# EAGLE board haasoscope_pro_fpga_board - start of io (EAGLE 9.6.2), part 1 of 2
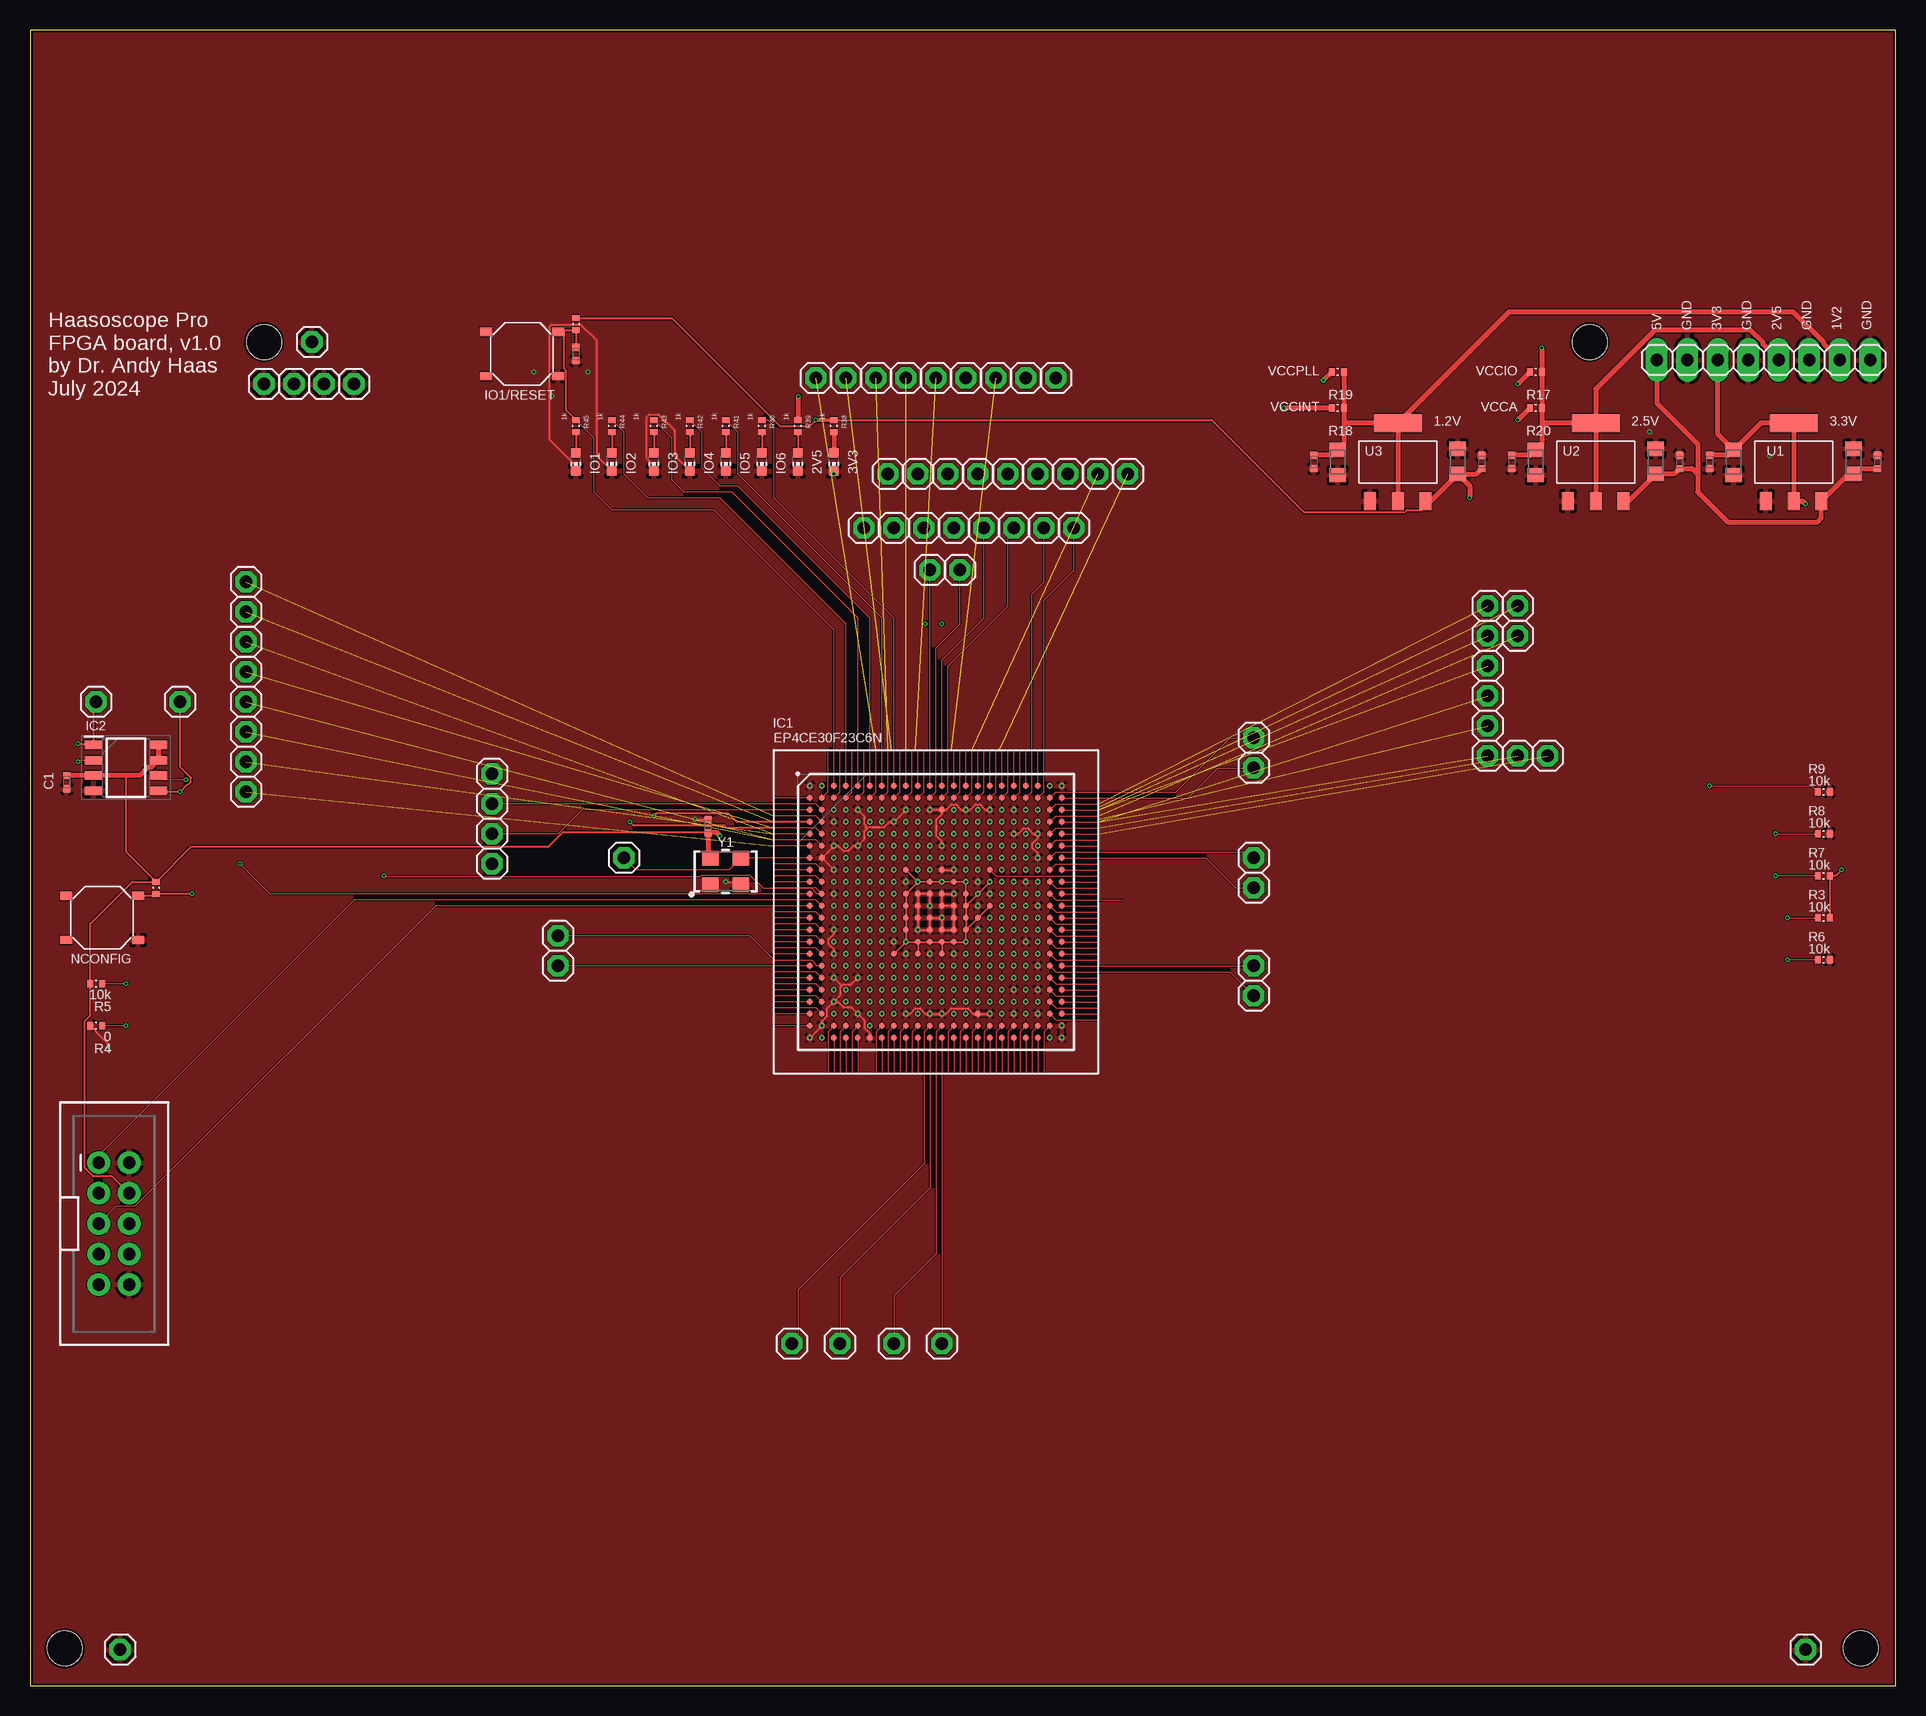
[diagram p4: board, top side]
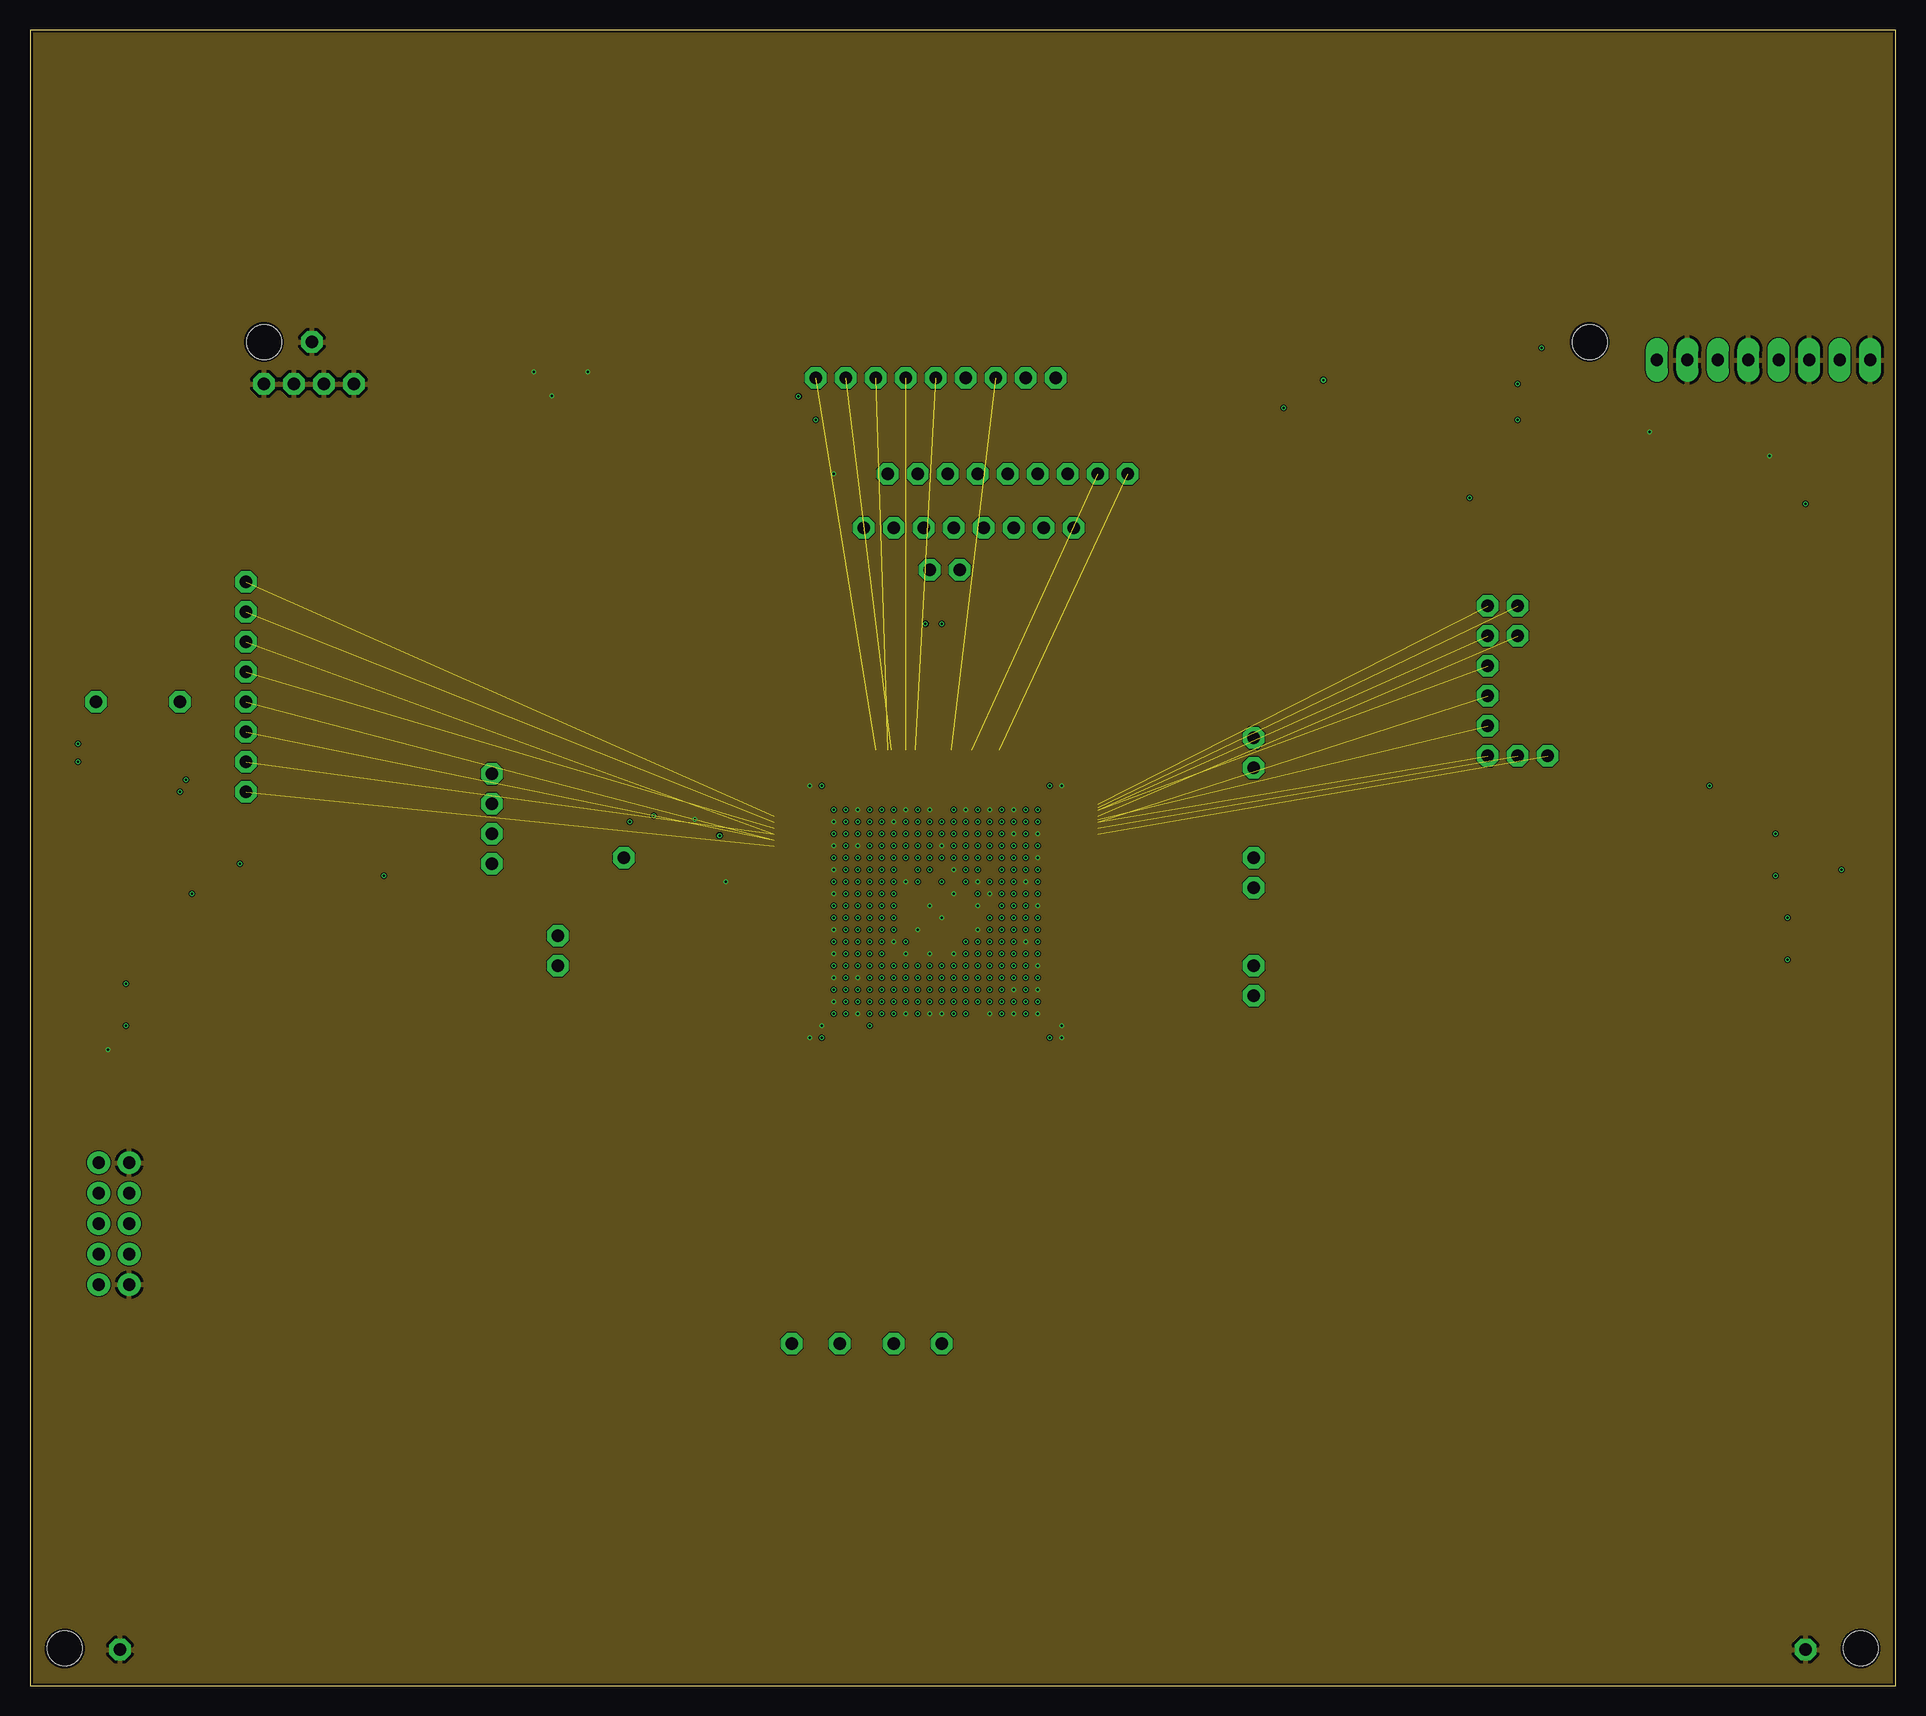
[diagram p5: board, inner layer topgnd]
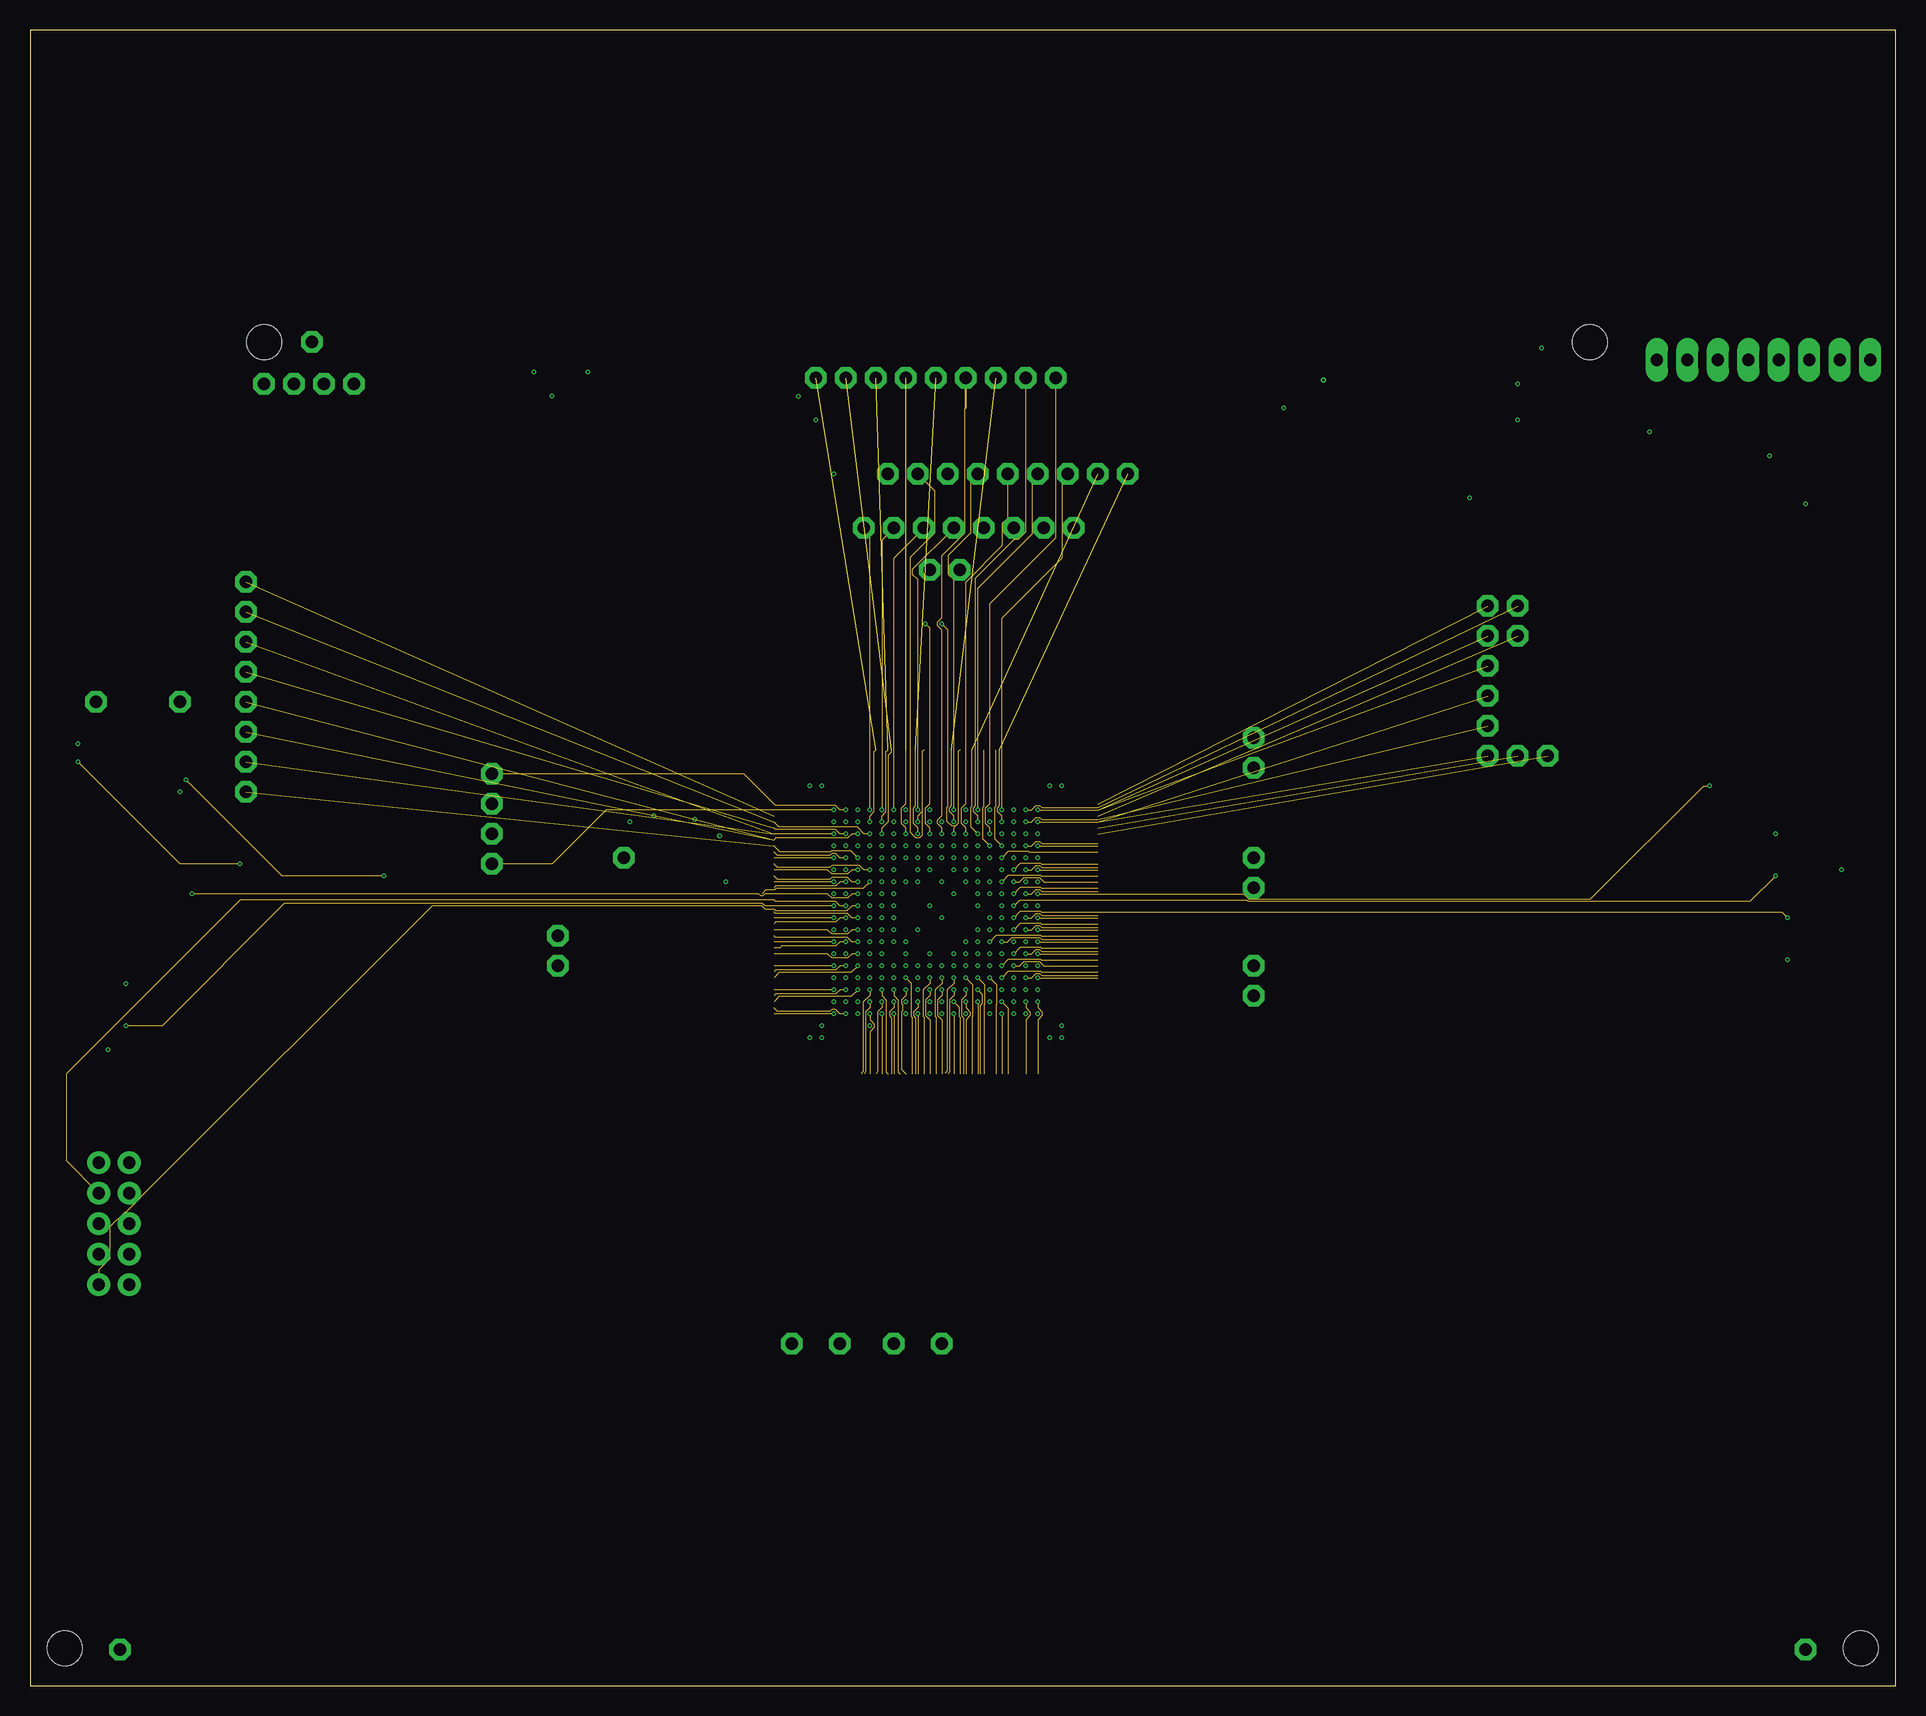
[diagram p6: board, inner layer sig2]
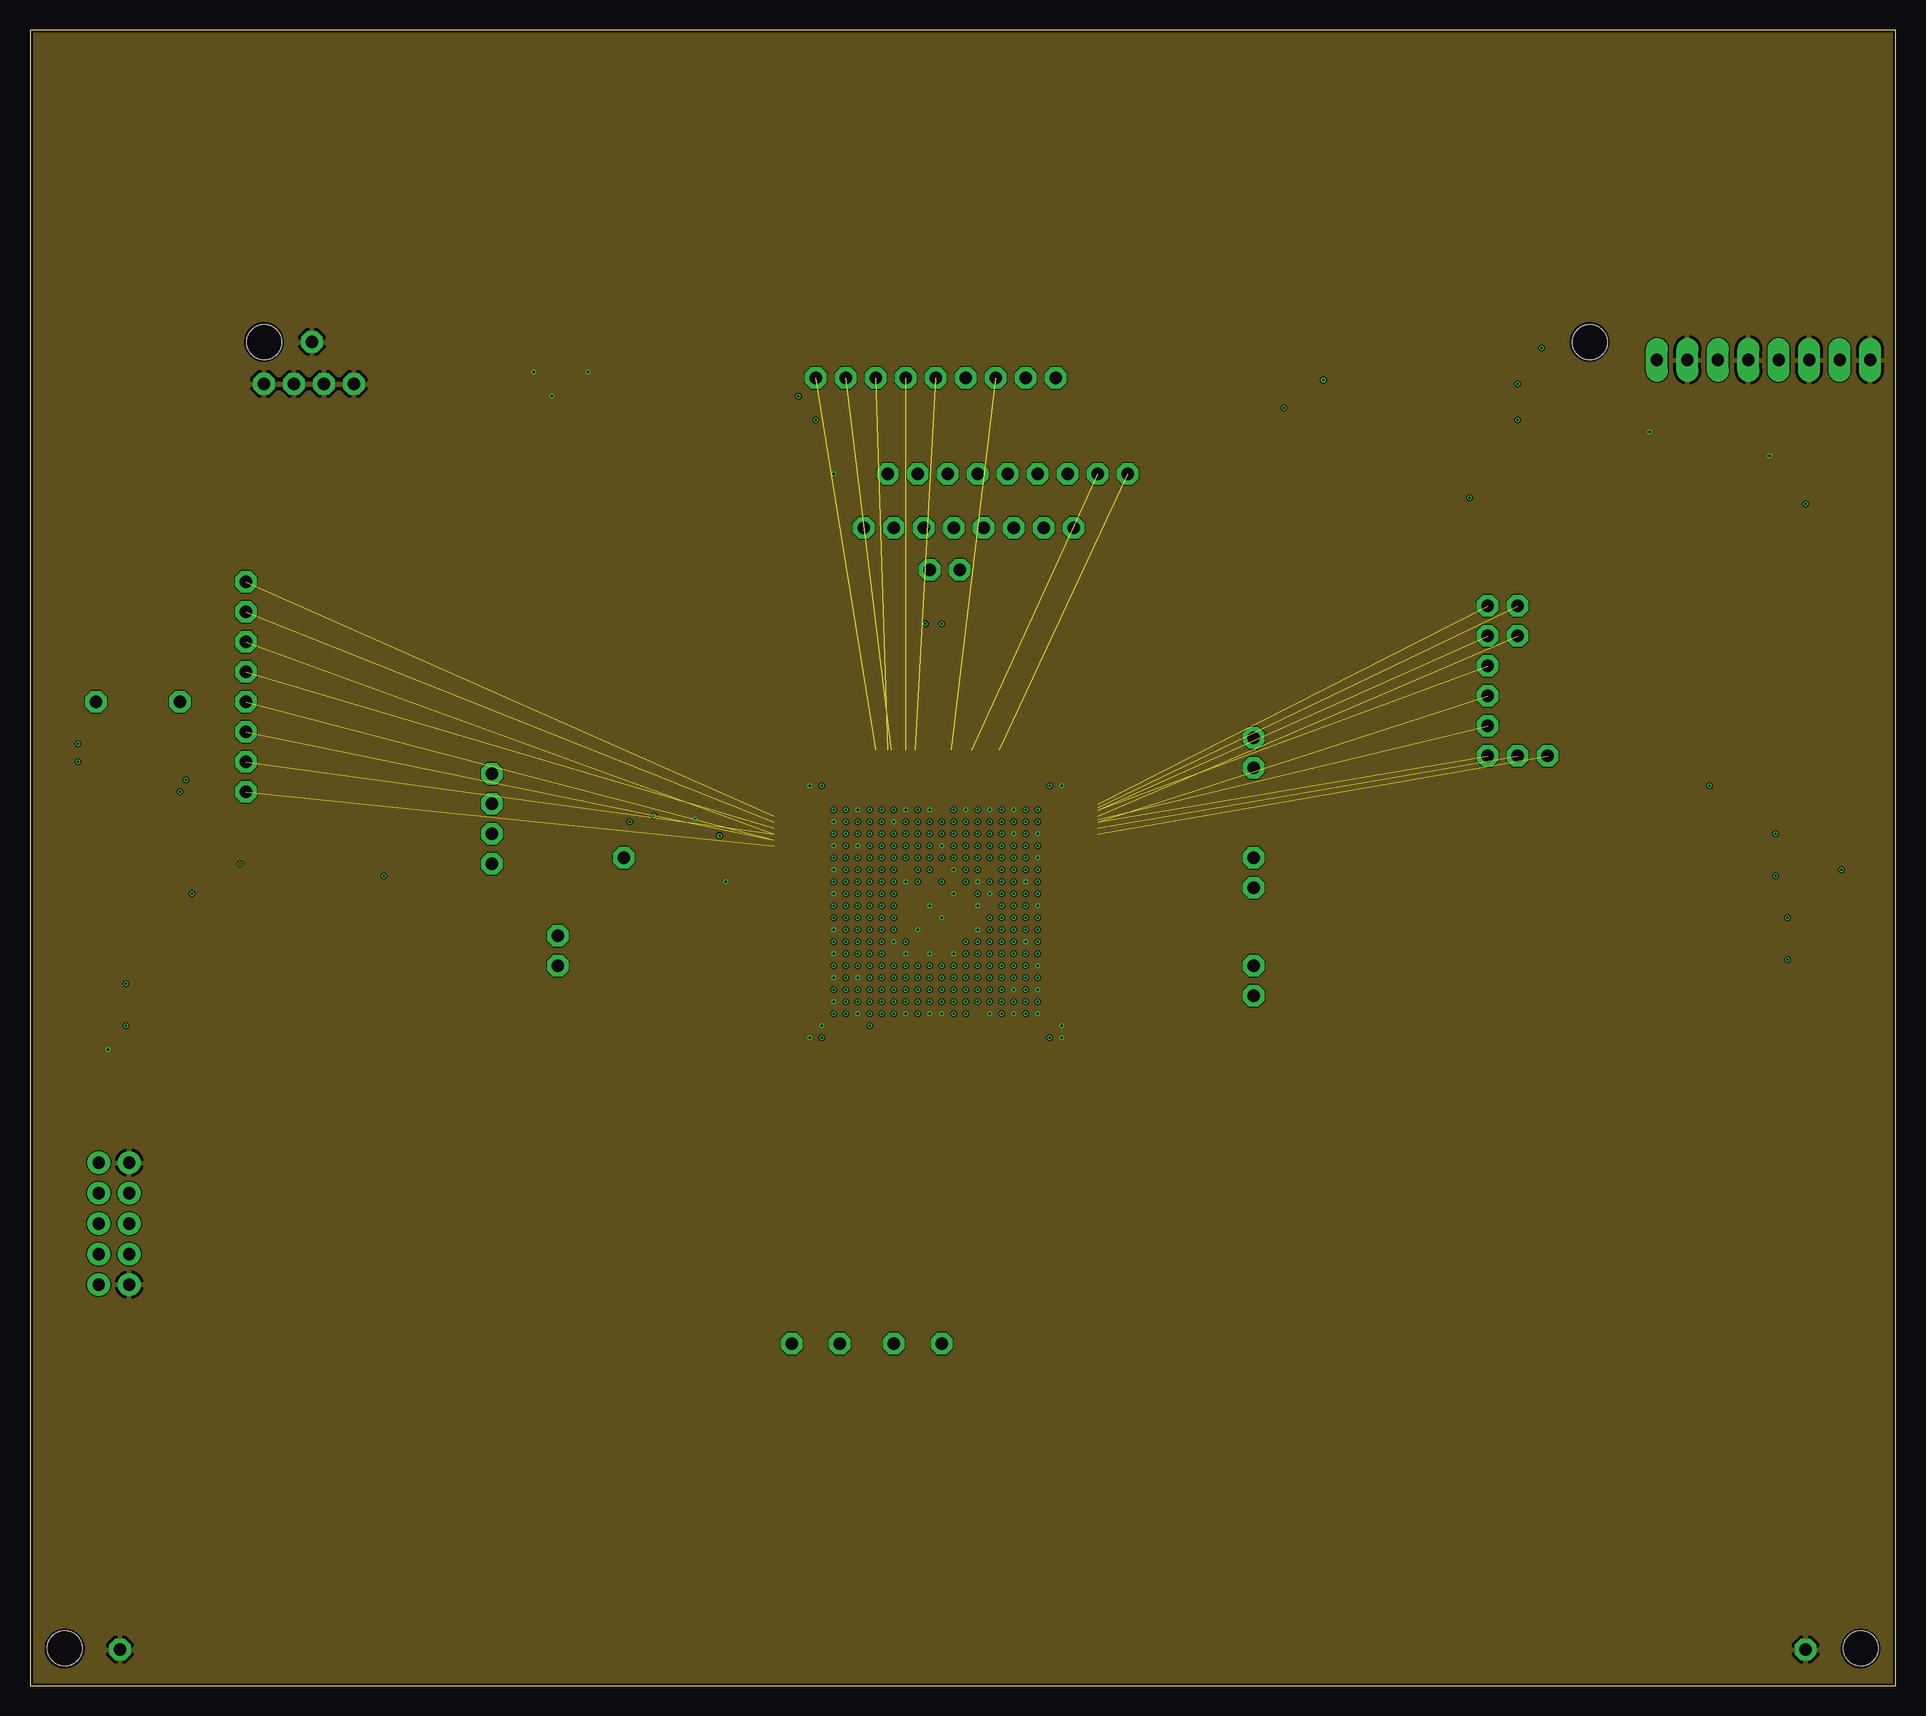
[diagram p7: board, inner layer sig2gnd]
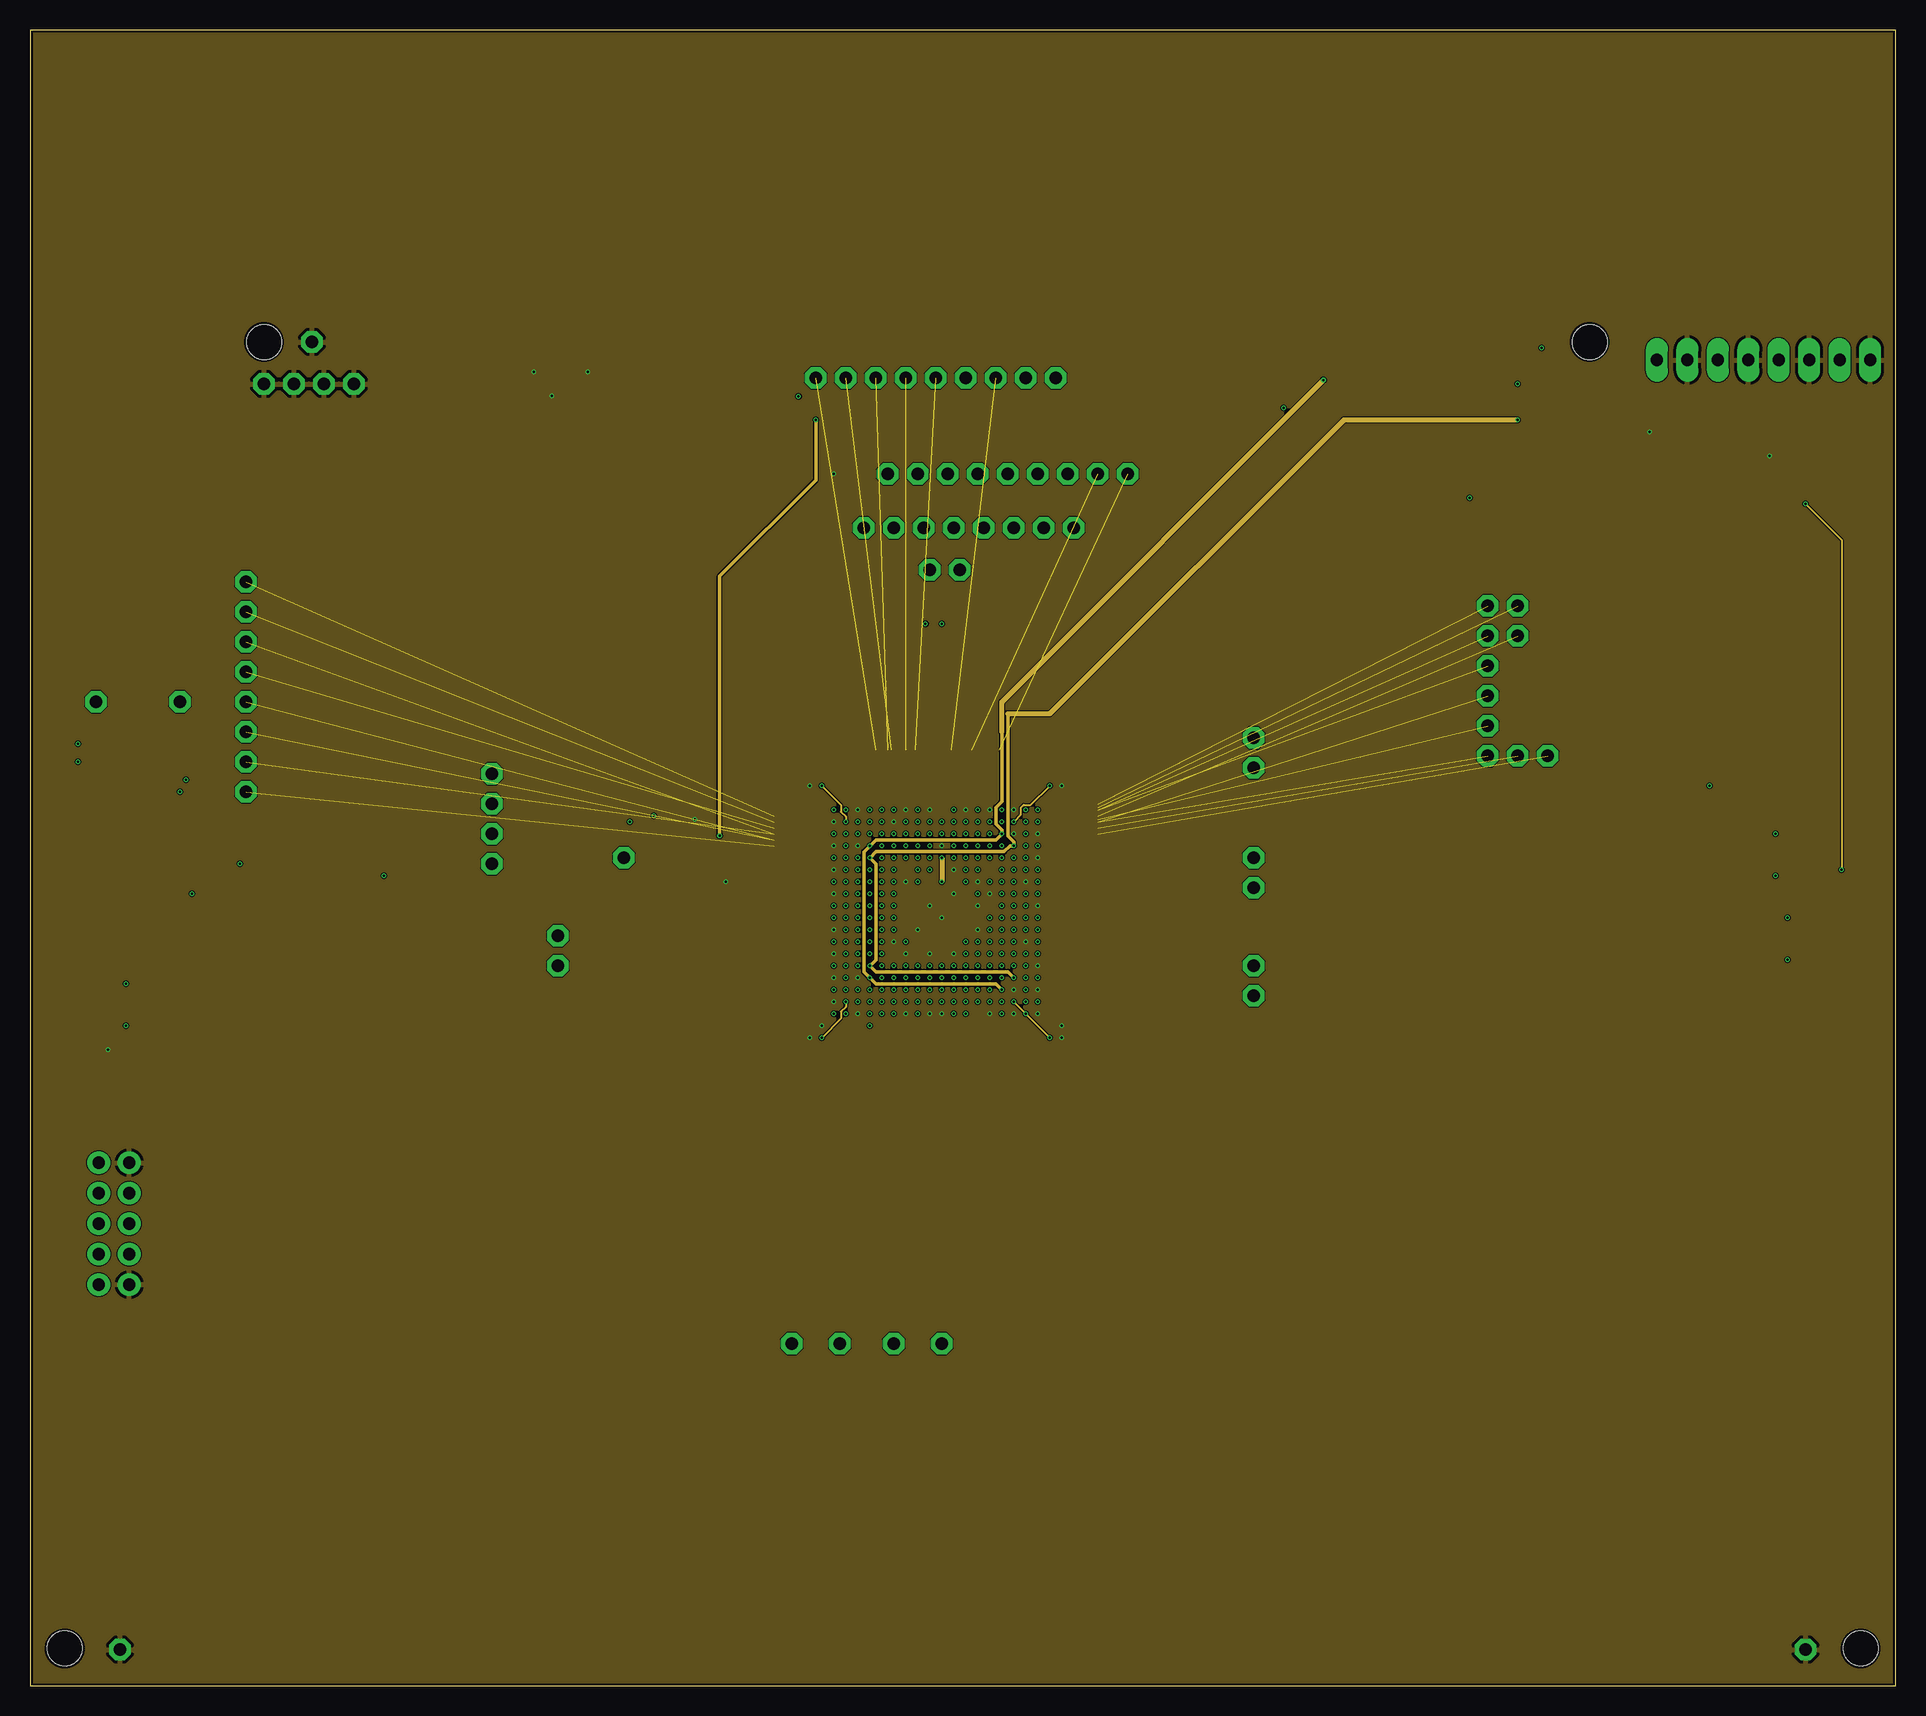
[diagram p8: board, inner layer pow1]
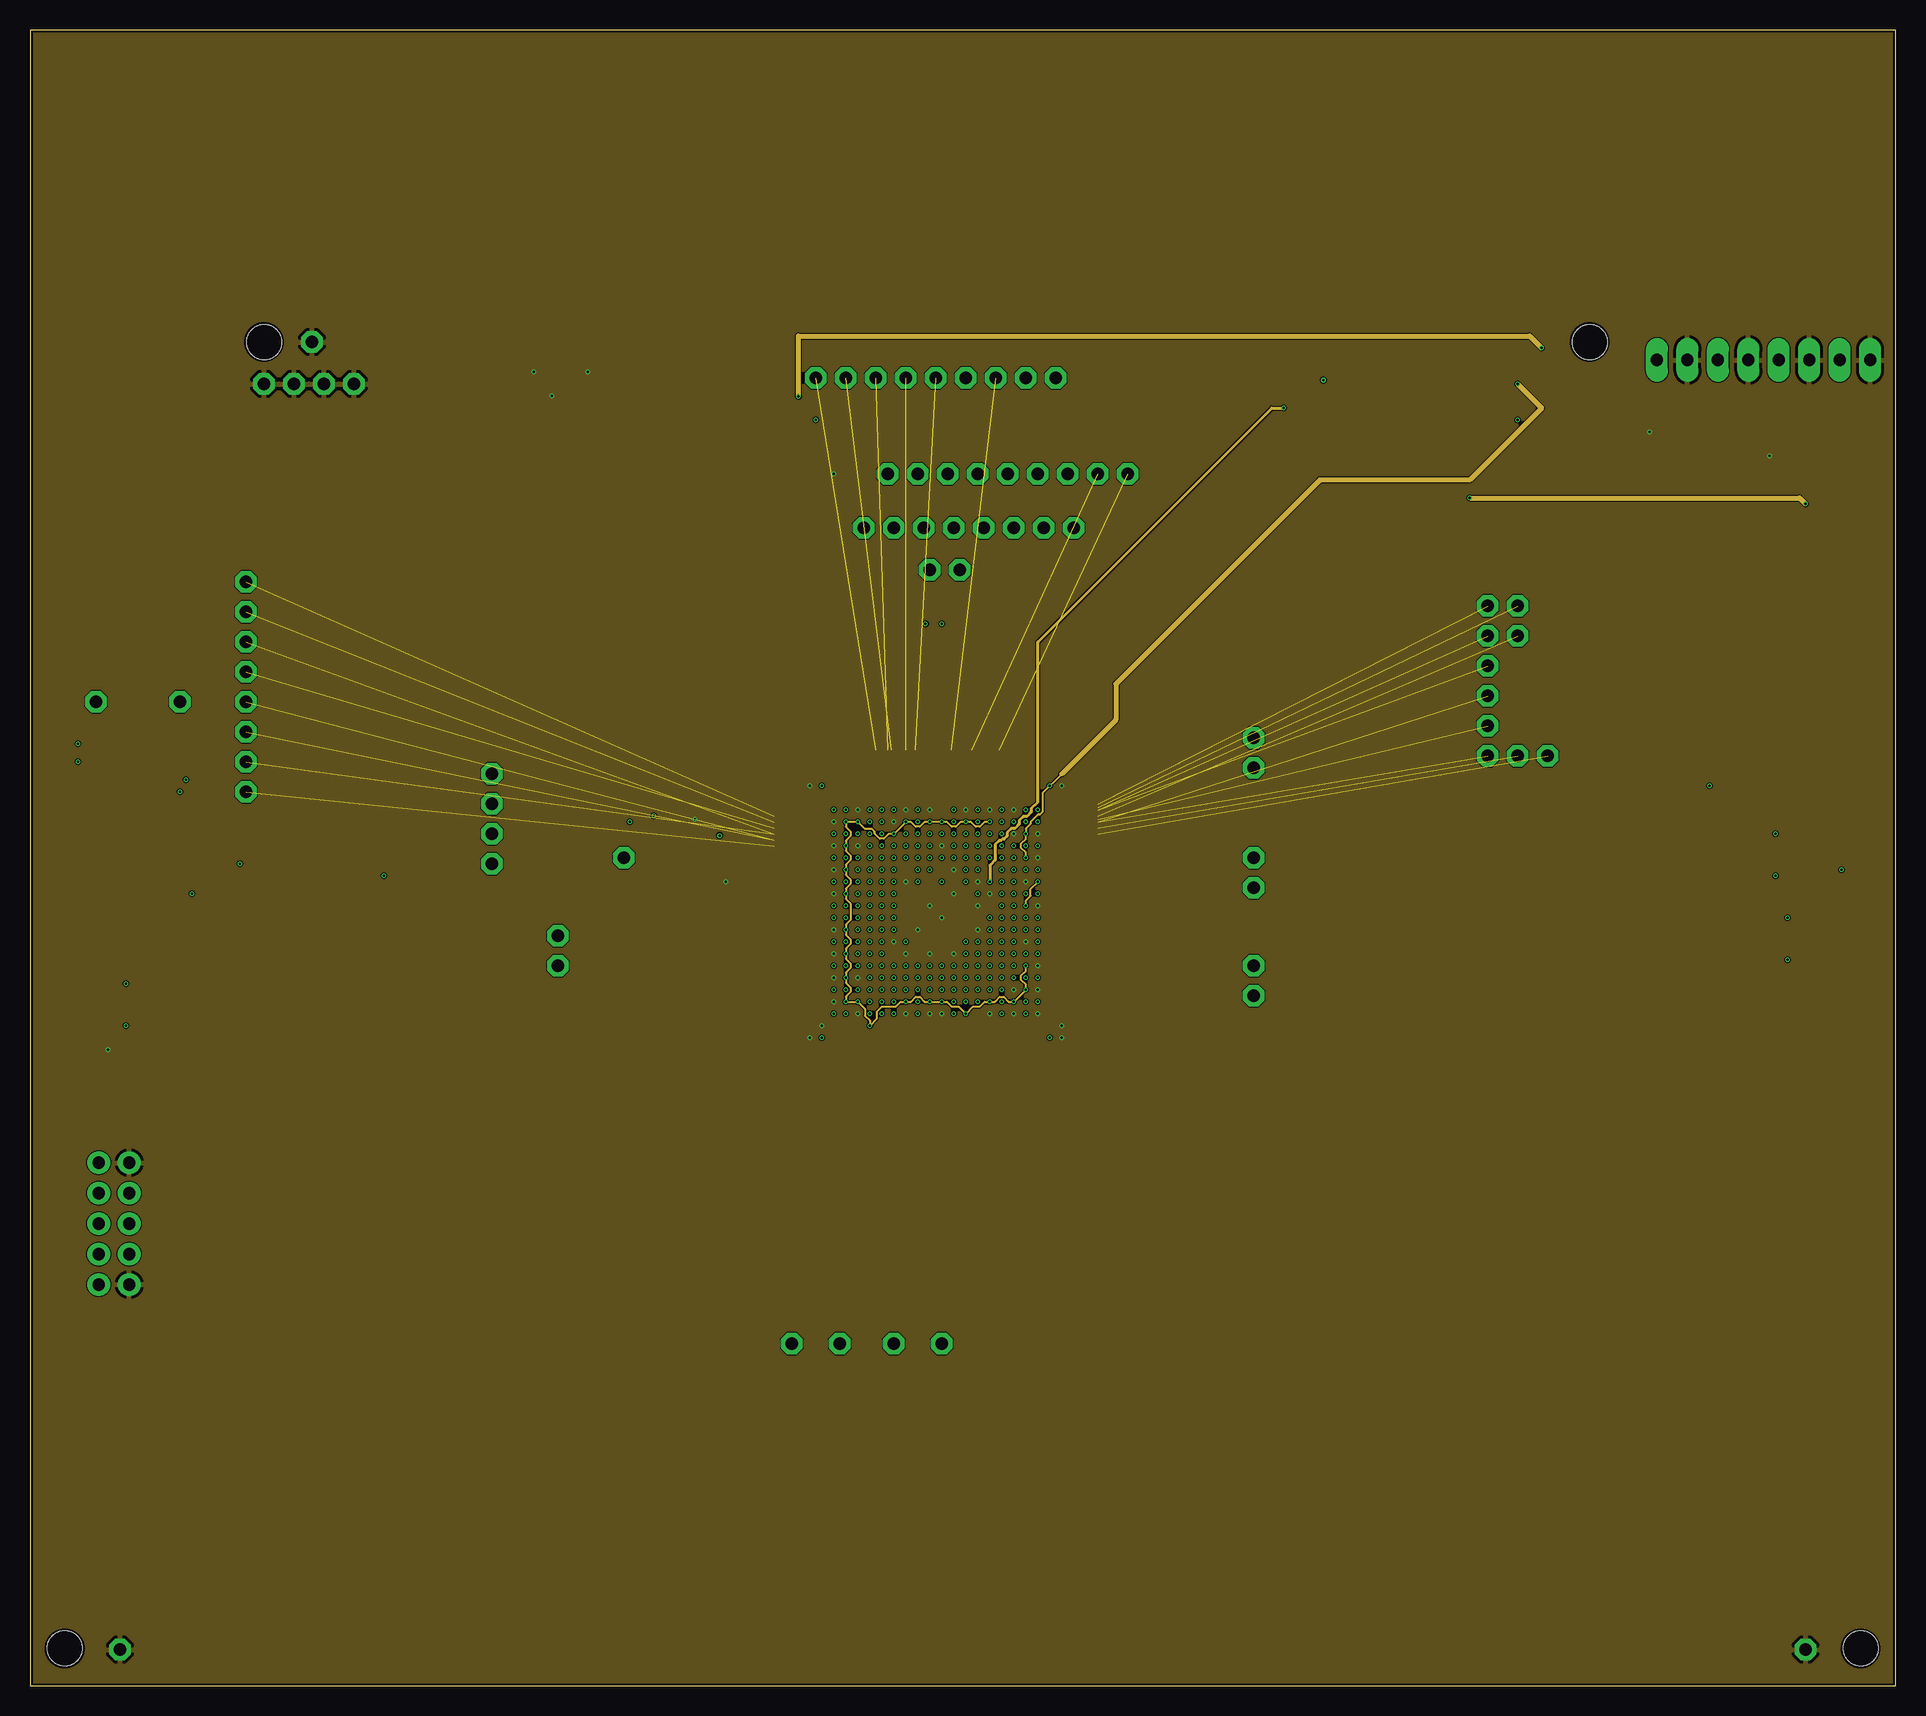
[diagram p9: board, inner layer pow2]
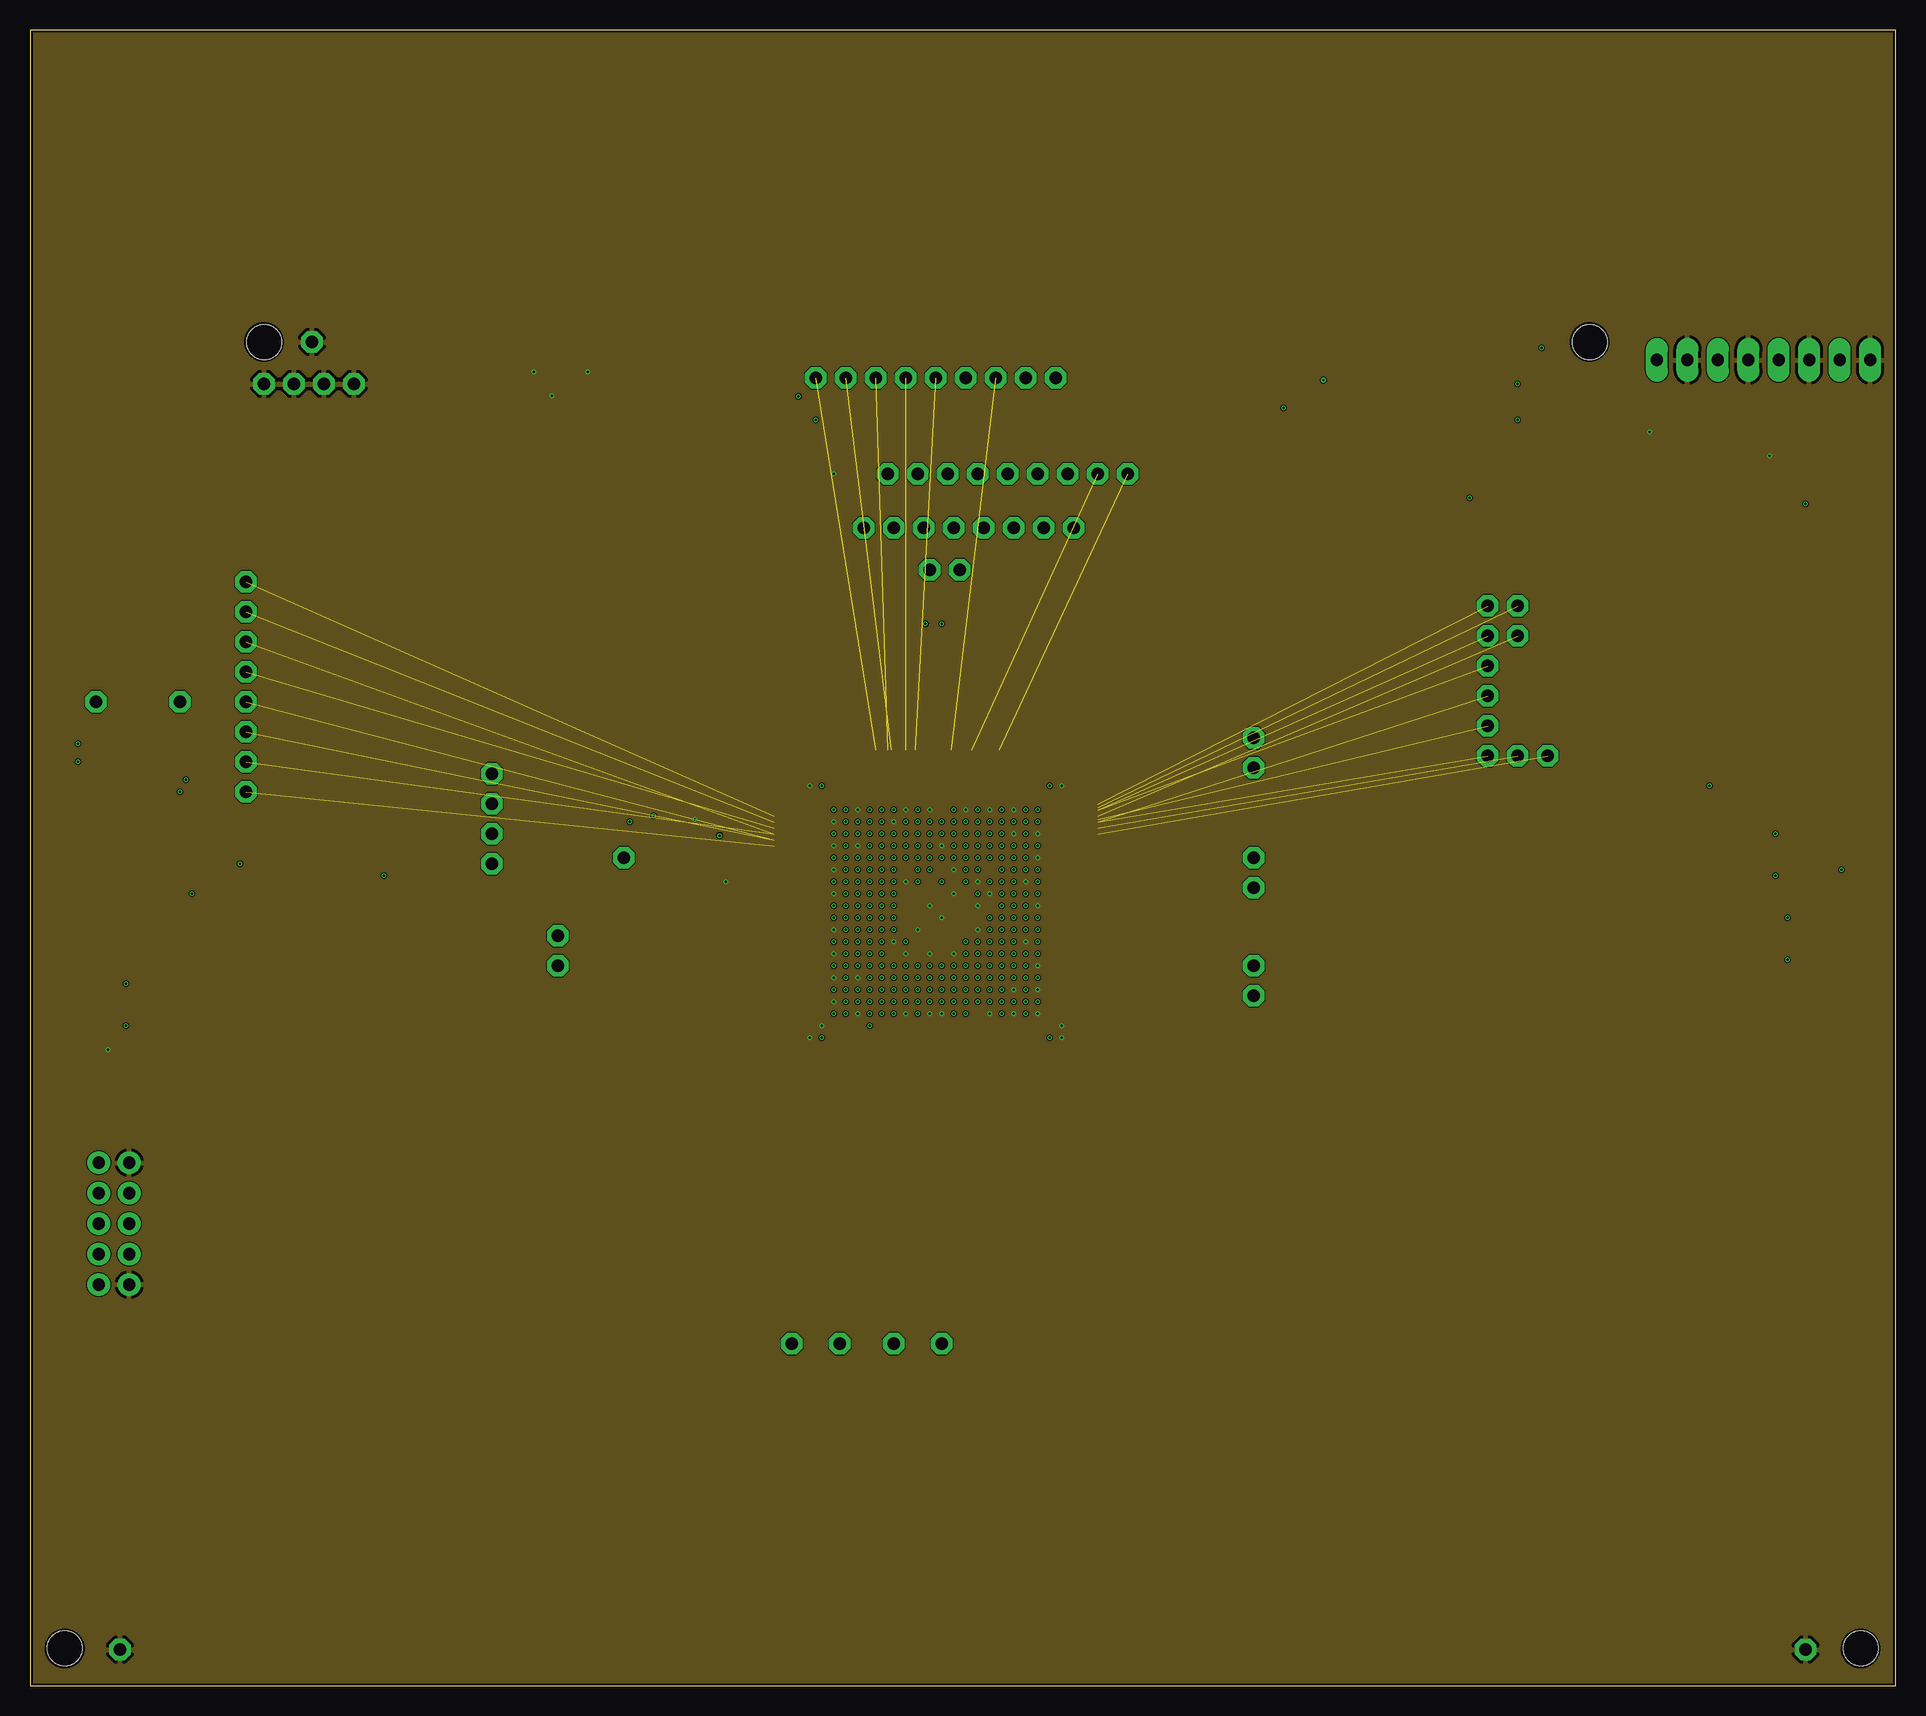
[diagram p10: board, inner layer sig4gnd]
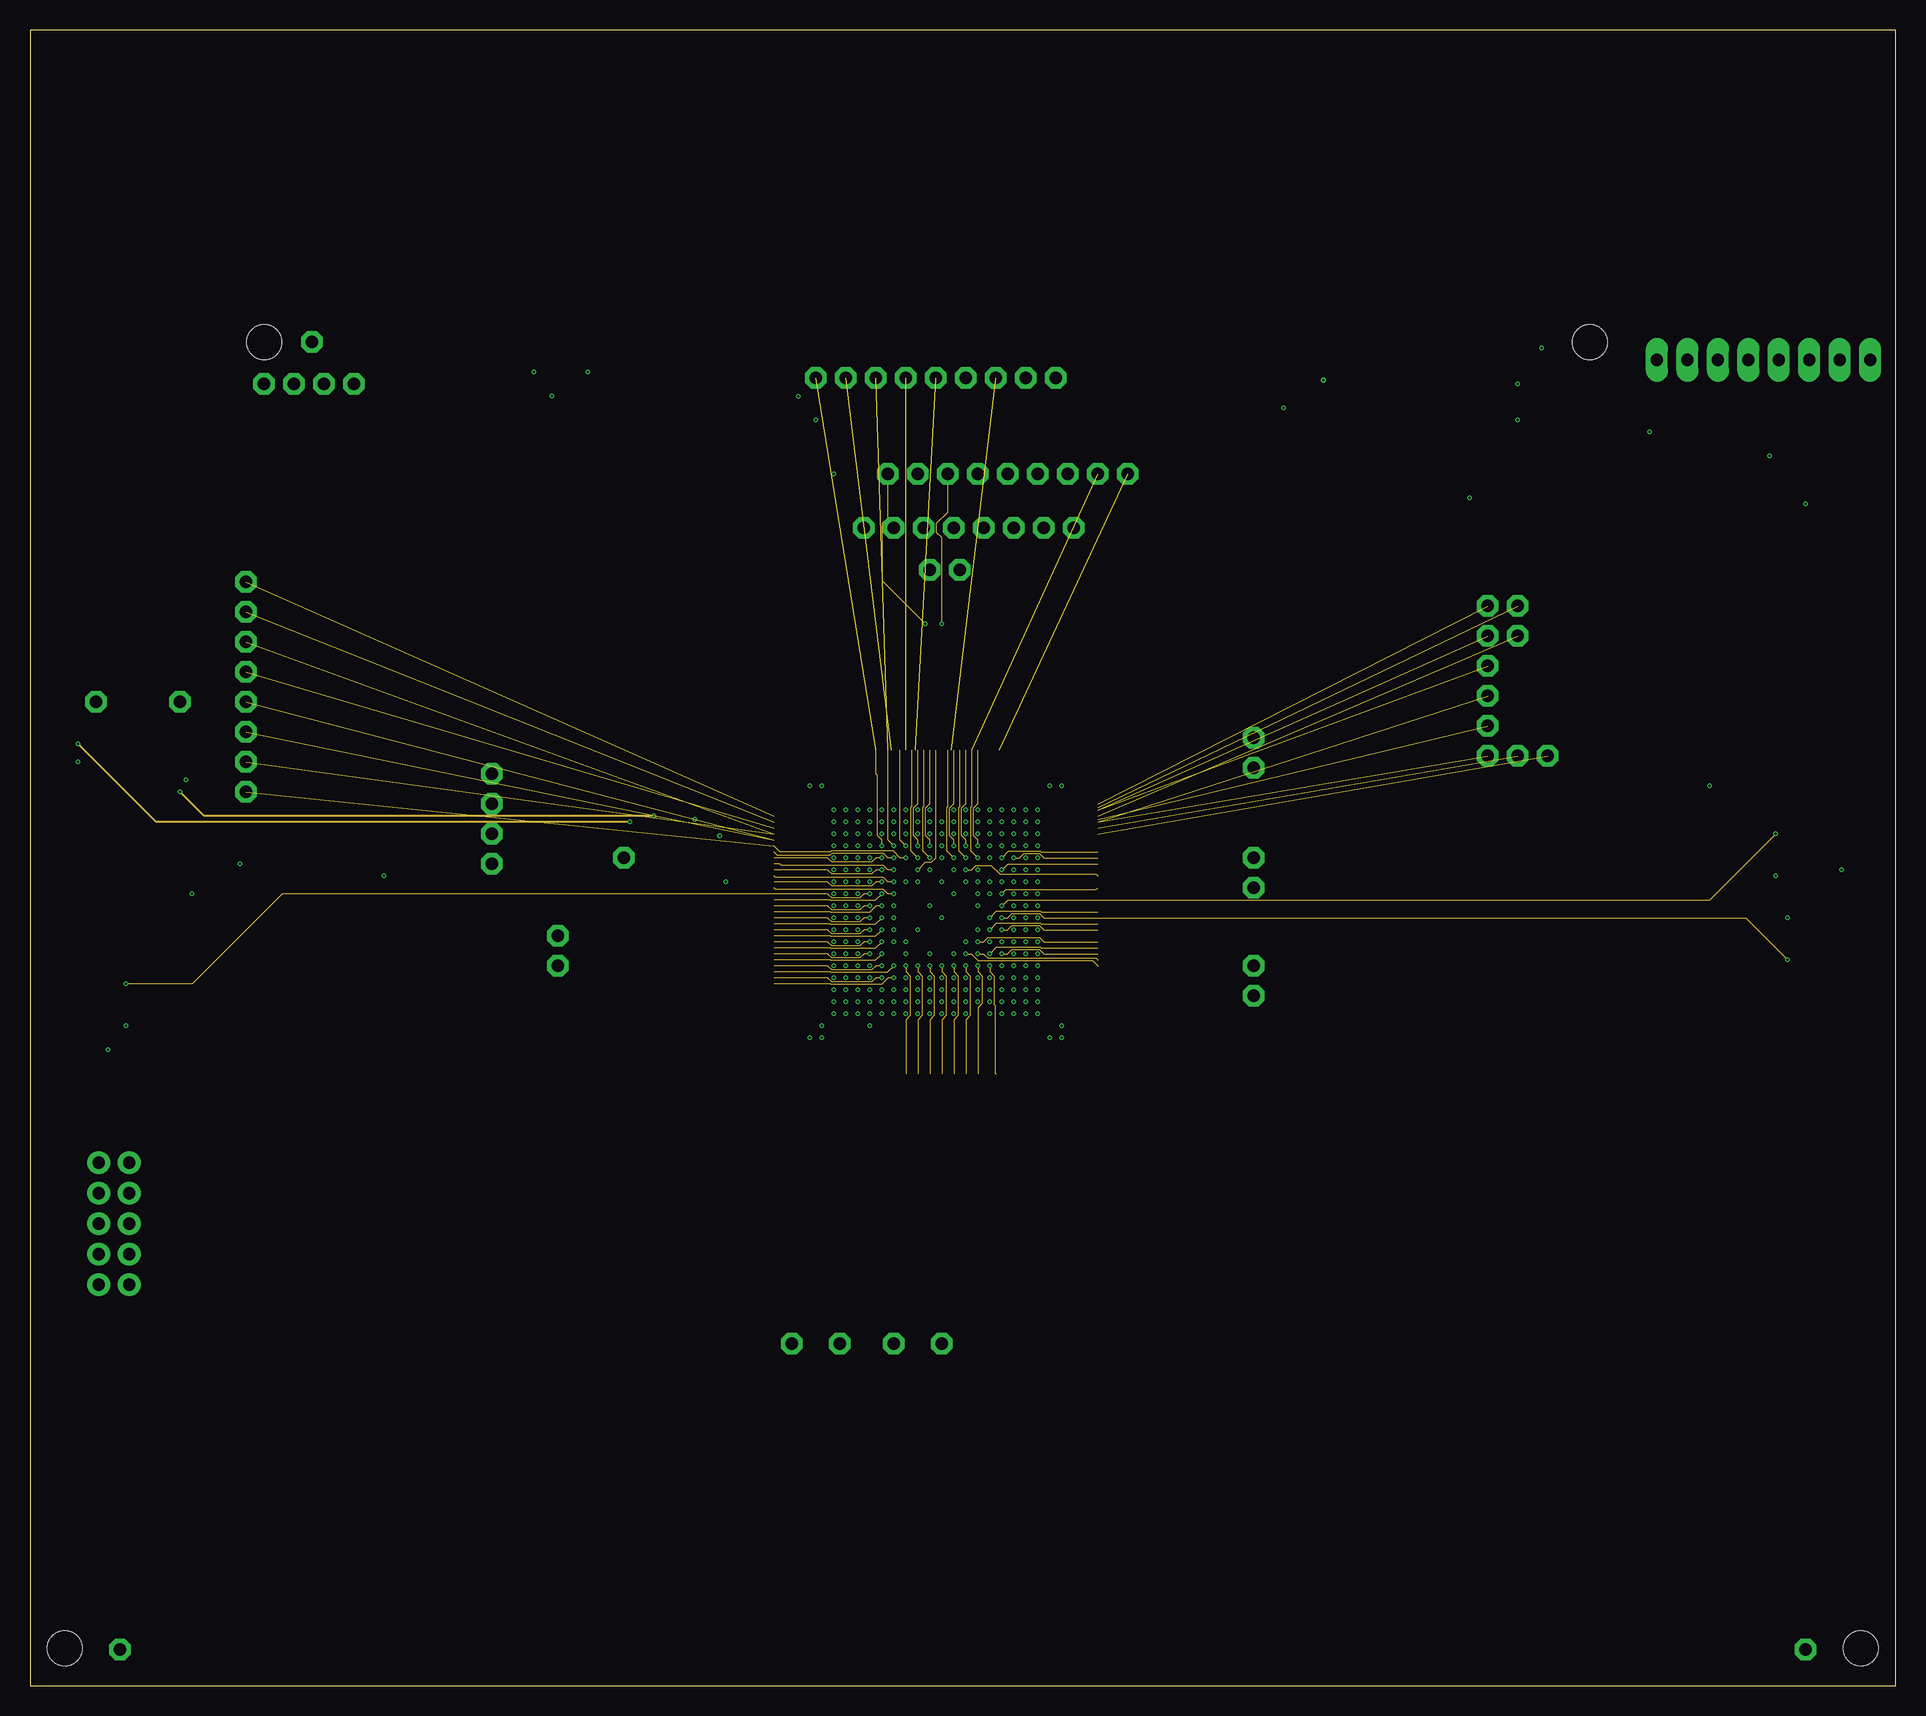
[diagram p11: board, inner layer sig4]
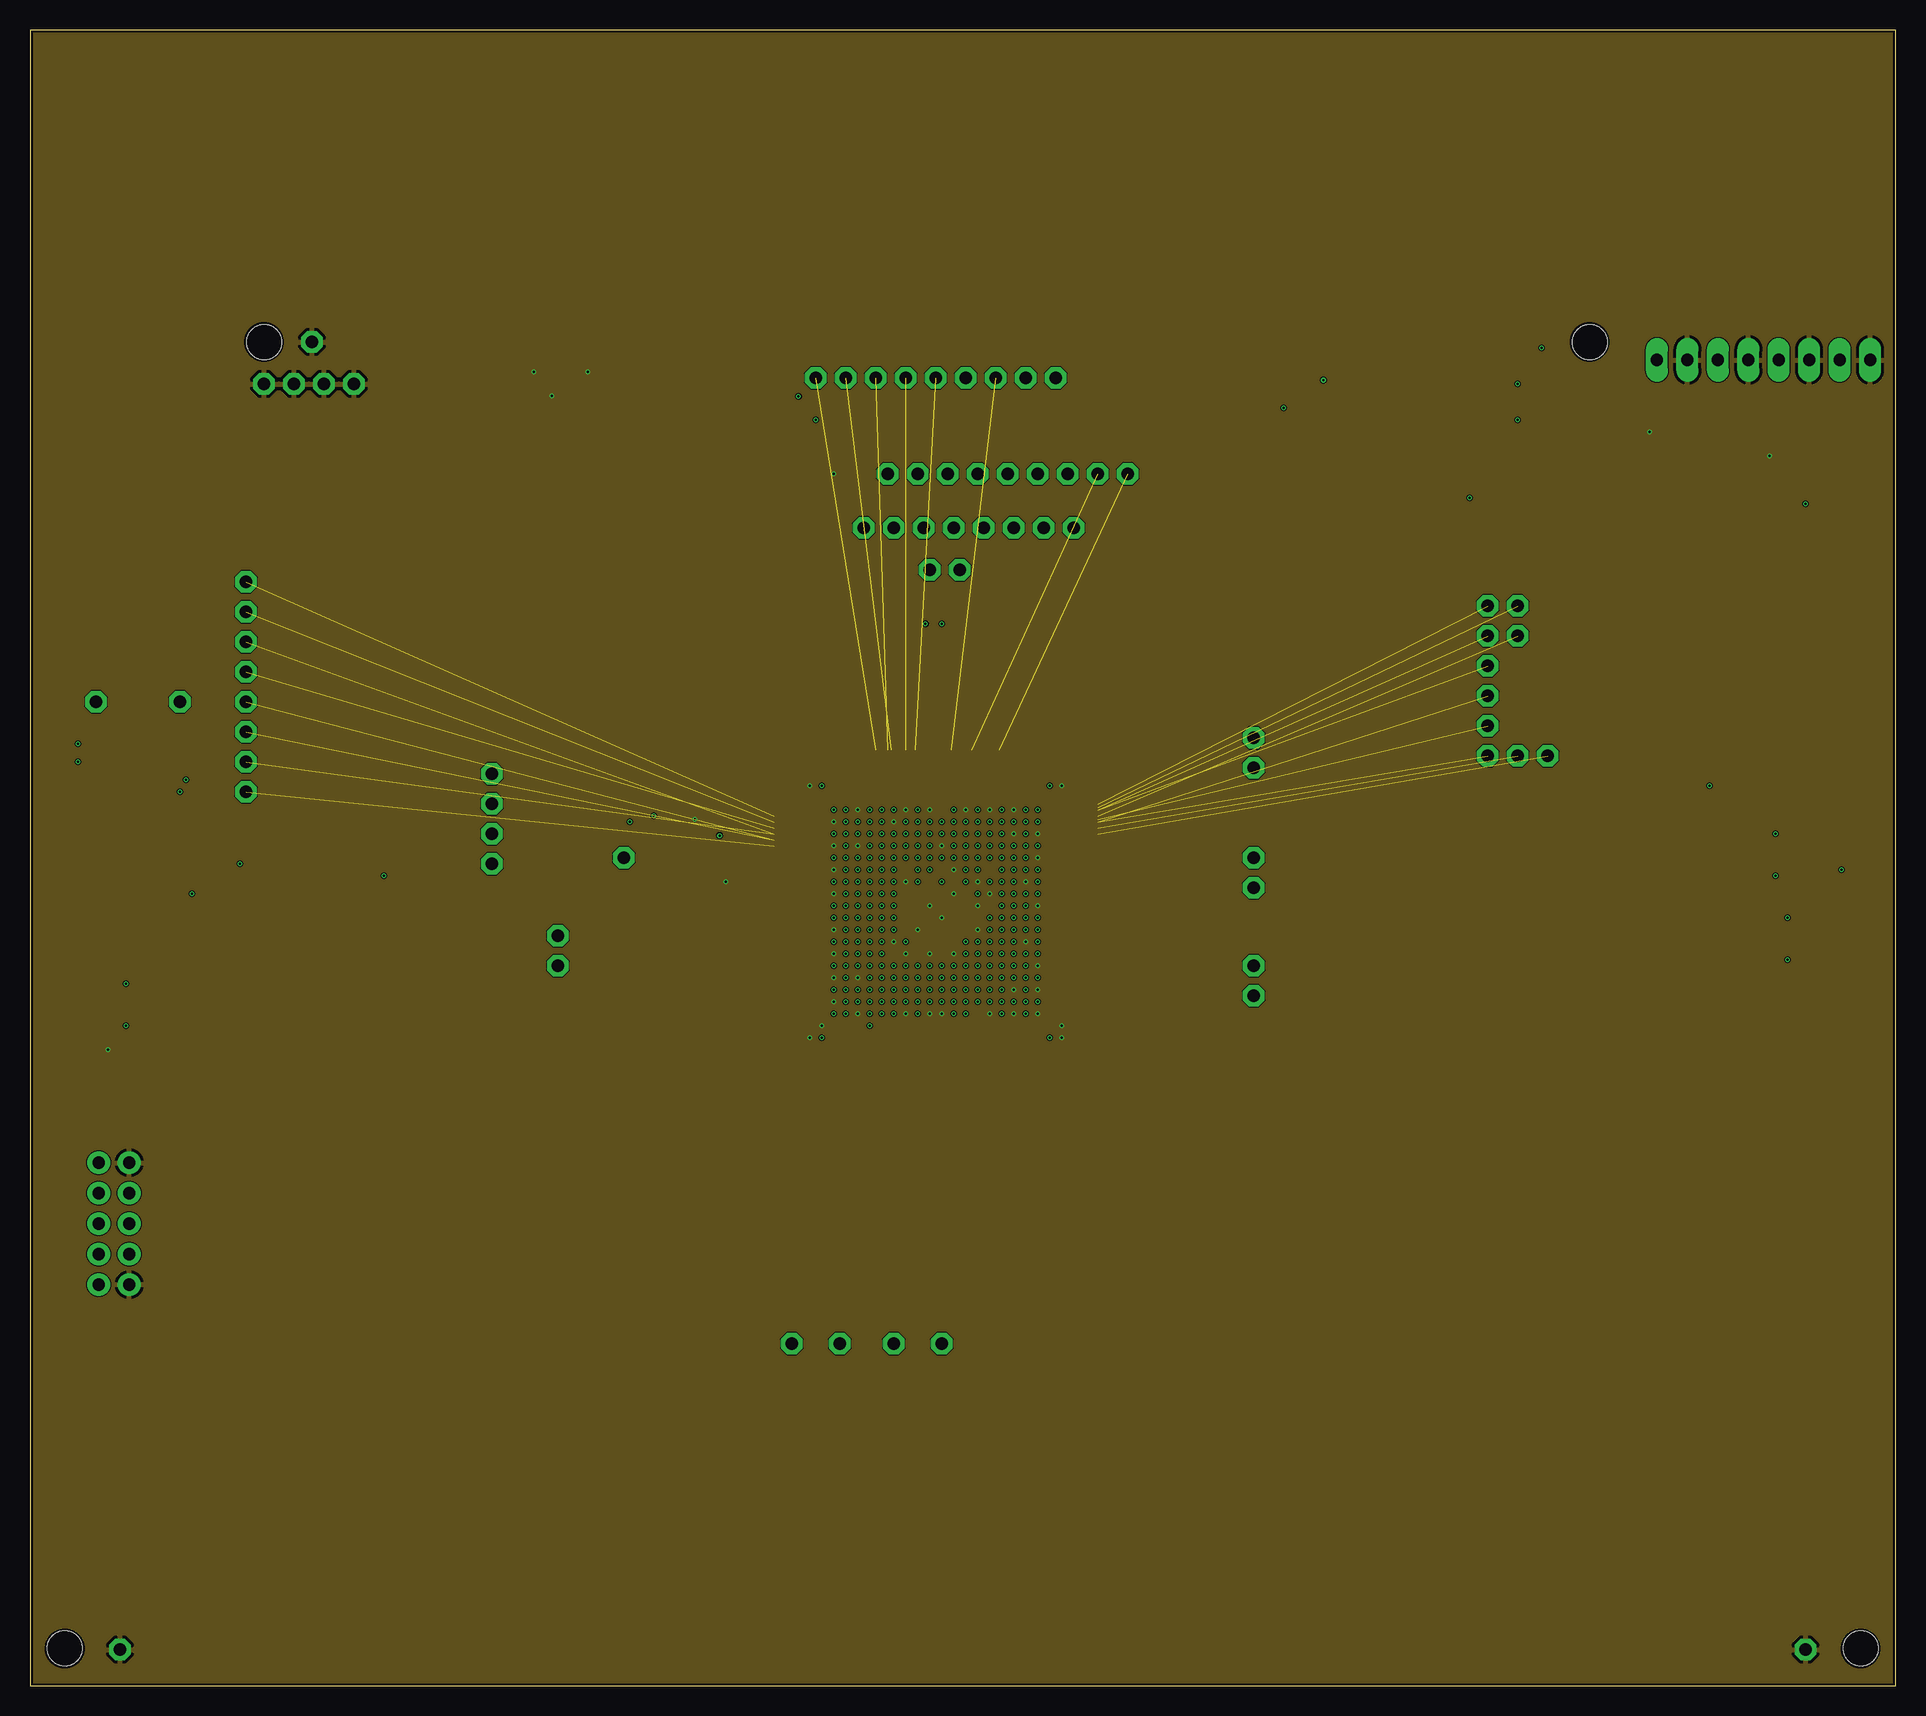
[diagram p12: board, inner layer sig5gnd]
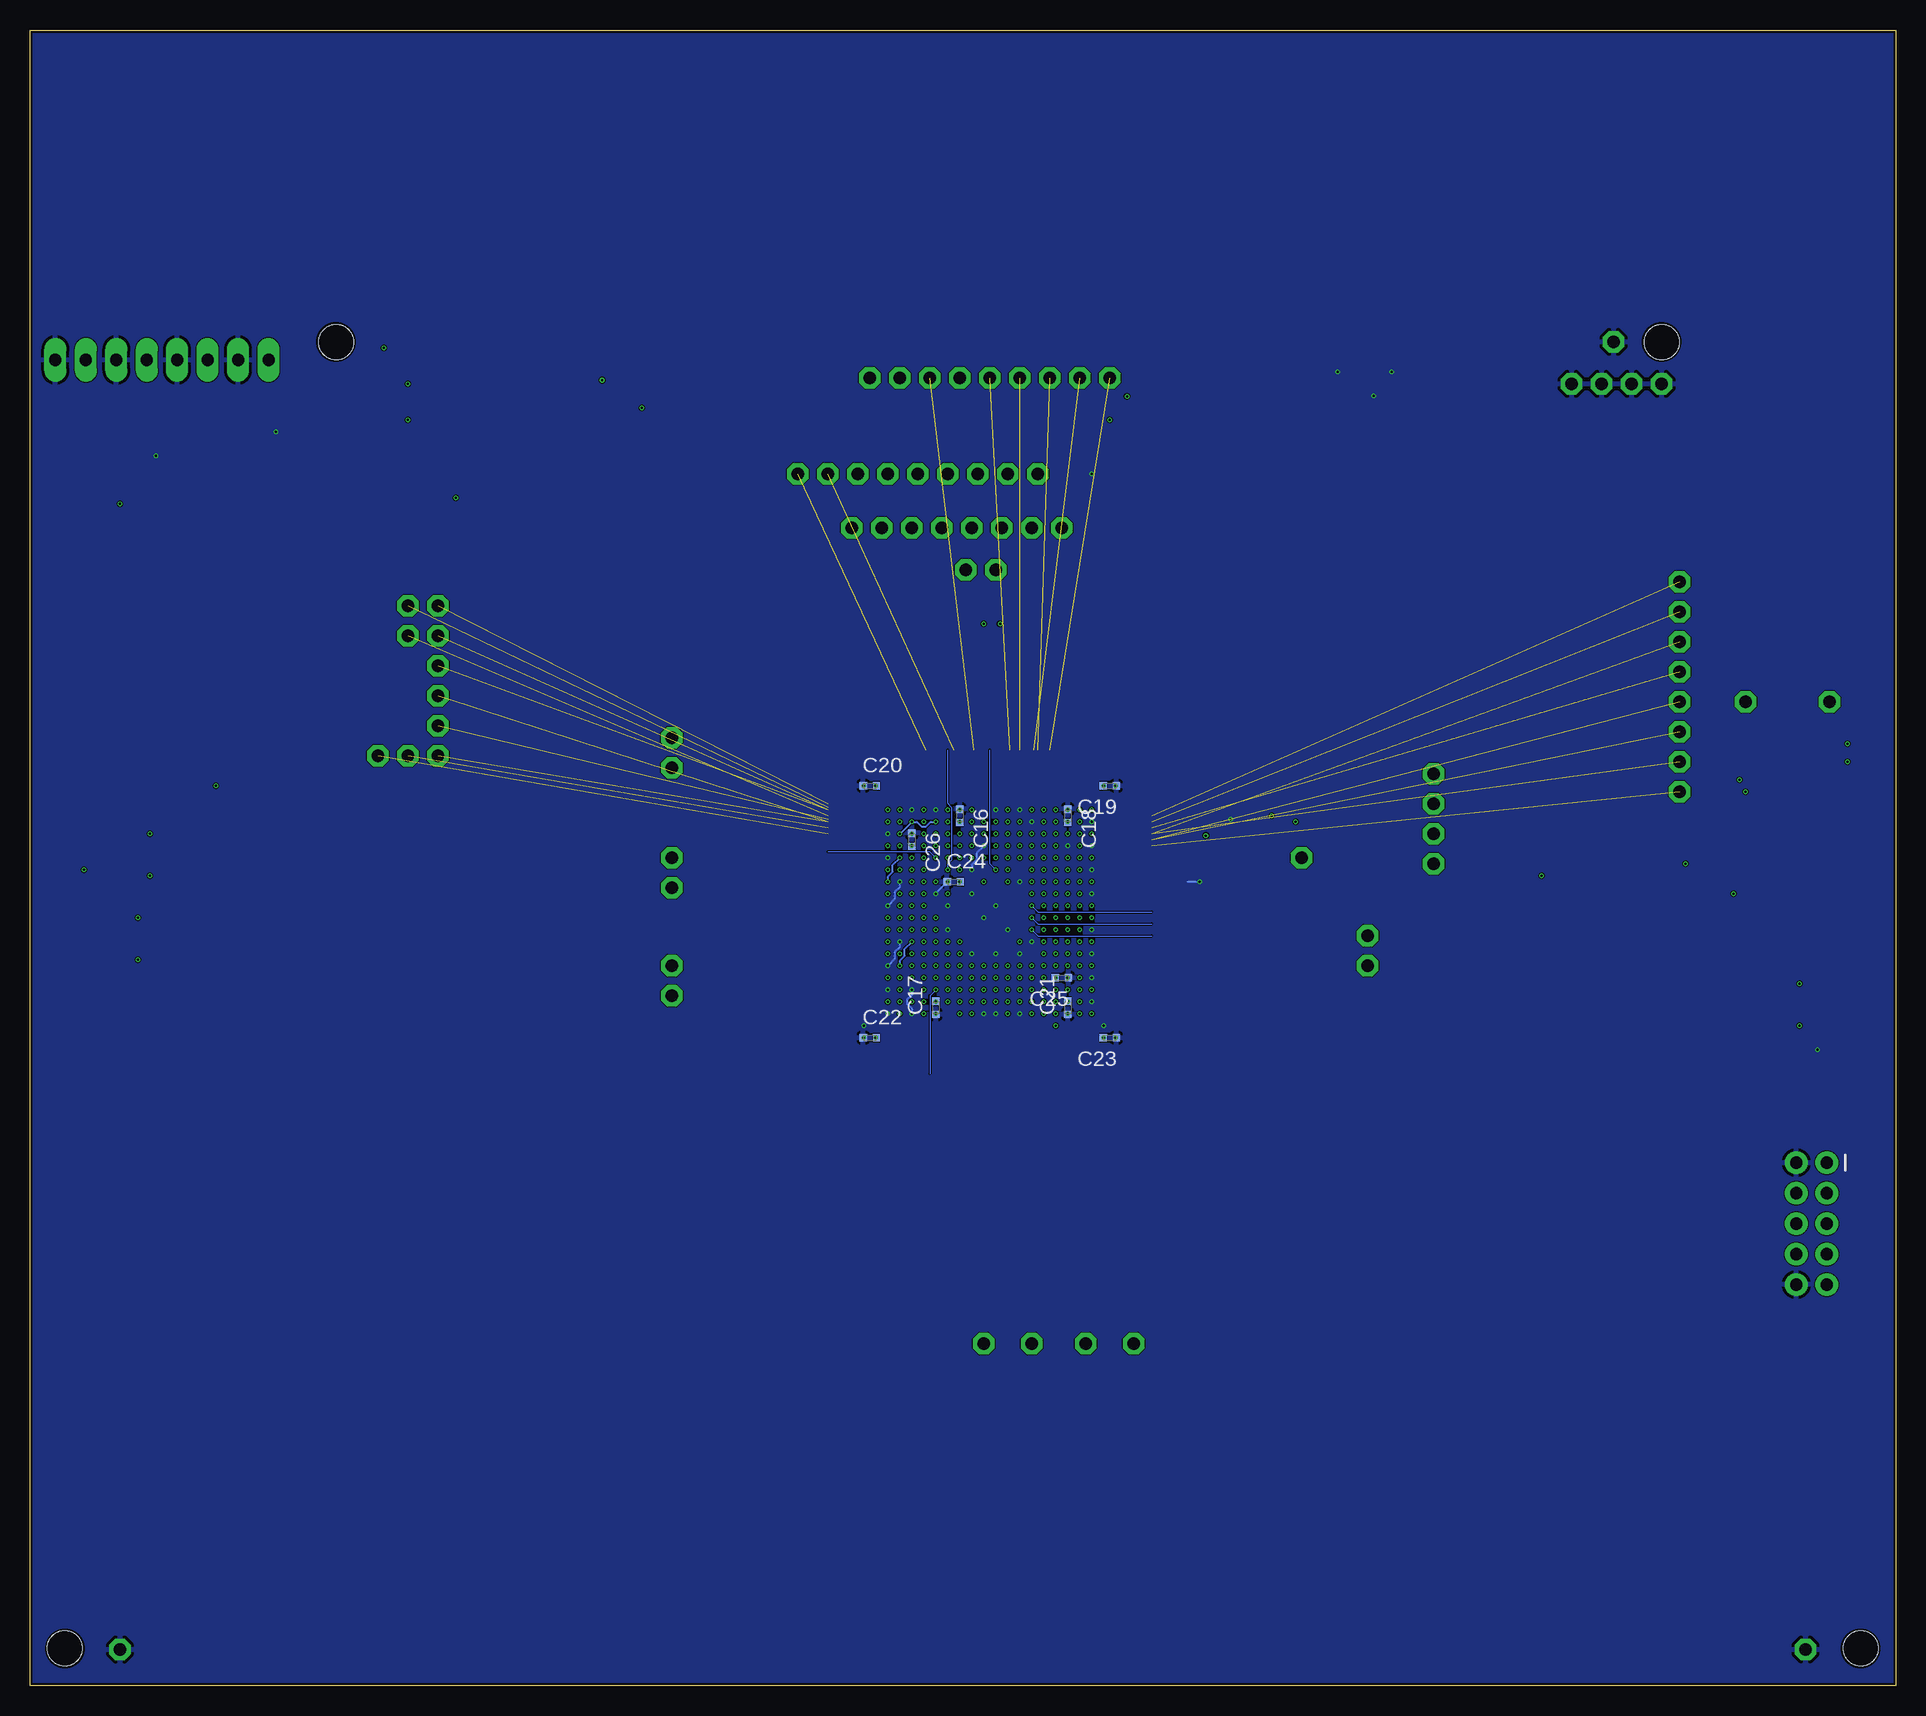
[diagram p13: board, bottom side, seen from below]

Size 155.5 x 138 mm. Coordinates in mm from the lower left corner, seen from the top.
Outline: 0,138 0,0 155.5,0 155.5,138 0,138
Copper layers (1+2*3+4*5+12*13+14*15+16): top 0.035mm / dielectric 0.2mm / topgnd 0.0175mm / dielectric 0.15mm / sig2 0.035mm / dielectric 0.2mm / sig2gnd 0.035mm / dielectric 0.15mm / pow1 0.035mm / dielectric 0.2mm / pow2 0.035mm / dielectric 0.15mm / sig4gnd 0.035mm / dielectric 0.2mm / sig4 0.035mm / dielectric 0.15mm / sig5gnd 0.0175mm / dielectric 0.2mm / sig5 0.035mm
Design rules "jlcpcb-10layers-haas": minimum track width 3.5mil, minimum drill 0.2mm, track to track 3.5mil, track to pad 5mil, pad to pad 5mil, via to via 0.5mm, smd to smd 5mil, copper to edge 0.2mm, drill to drill 6mil, minimum pad ring 10mil, minimum via ring 0.1mm, stop-mask expansion 0.05mm, vias tented up to drill 16mil, thermal gap 10mil
Net classes: 0 default: width 0.089 mm; 1 power: width 0.152 mm; 2 diffpair: width 0.089 mm; 3 loosediffpair: width 0.152 mm, clearance 0.305 mm to class 0, clearance 0.305 mm to class 1, clearance 0.305 mm to class 2, clearance 0.305 mm
Holes 2.9 mm at 2.9,3.1 152.6,3.1 19.5,112 130,112

## Footprints (pad centres in the part's own frame; a part is rotated, then mirrored left to right if it is on the bottom)
RESC0402_N = smd 0.6 x 0.6: 1 -0.55,0; 2 0.55,0
RESC0805_N = smd 1.2 x 1.35: 1 -1.1,0; 2 1,0
BGA484C100P22X22_2300X2300X240 = smd 0.5 x 0.5: A1 -10.5,10.5; A2 -9.5,10.5; A3 -8.5,10.5; A4 -7.5,10.5; A5 -6.5,10.5; A6 -5.5,10.5; A7 -4.5,10.5; A8 -3.5,10.5; A9 -2.5,10.5; A10 -1.5,10.5; A11 -0.5,10.5; A12 0.5,10.5; A13 1.5,10.5; A14 2.5,10.5; A15 3.5,10.5; A16 4.5,10.5; A17 5.5,10.5; A18 6.5,10.5; A19 7.5,10.5; A20 8.5,10.5; A21 9.5,10.5; A22 10.5,10.5; AA1 -10.5,-9.5; AA2 -9.5,-9.5; AA3 -8.5,-9.5; AA4 -7.5,-9.5; AA5 -6.5,-9.5; AA6 -5.5,-9.5; AA7 -4.5,-9.5; AA8 -3.5,-9.5; AA9 -2.5,-9.5; AA10 -1.5,-9.5; AA11 -0.5,-9.5; AA12 0.5,-9.5; AA13 1.5,-9.5; AA14 2.5,-9.5; AA15 3.5,-9.5; AA16 4.5,-9.5; AA17 5.5,-9.5; AA18 6.5,-9.5; AA19 7.5,-9.5; AA20 8.5,-9.5; AA21 9.5,-9.5; AA22 10.5,-9.5; AB1 -10.5,-10.5; AB2 -9.5,-10.5; AB3 -8.5,-10.5; AB4 -7.5,-10.5; AB5 -6.5,-10.5; AB6 -5.5,-10.5; AB7 -4.5,-10.5; AB8 -3.5,-10.5; AB9 -2.5,-10.5; AB10 -1.5,-10.5; AB11 -0.5,-10.5; AB12 0.5,-10.5; AB13 1.5,-10.5; AB14 2.5,-10.5; AB15 3.5,-10.5; AB16 4.5,-10.5; AB17 5.5,-10.5; AB18 6.5,-10.5; AB19 7.5,-10.5; AB20 8.5,-10.5; AB21 9.5,-10.5; AB22 10.5,-10.5; B1 -10.5,9.5; B2 -9.5,9.5; B3 -8.5,9.5; B4 -7.5,9.5; B5 -6.5,9.5; B6 -5.5,9.5; B7 -4.5,9.5; B8 -3.5,9.5; B9 -2.5,9.5; B10 -1.5,9.5; B11 -0.5,9.5; B12 0.5,9.5; B13 1.5,9.5; B14 2.5,9.5; B15 3.5,9.5; B16 4.5,9.5; B17 5.5,9.5; B18 6.5,9.5; B19 7.5,9.5; B20 8.5,9.5; B21 9.5,9.5; B22 10.5,9.5; C1 -10.5,8.5; C2 -9.5,8.5; C3 -8.5,8.5; C4 -7.5,8.5; C5 -6.5,8.5; C6 -5.5,8.5; C7 -4.5,8.5; C8 -3.5,8.5; C9 -2.5,8.5; C10 -1.5,8.5; C11 -0.5,8.5; C12 0.5,8.5; C13 1.5,8.5; C14 2.5,8.5; C15 3.5,8.5; C16 4.5,8.5; C17 5.5,8.5; C18 6.5,8.5; C19 7.5,8.5; C20 8.5,8.5; C21 9.5,8.5; C22 10.5,8.5; D1 -10.5,7.5; D2 -9.5,7.5; D3 -8.5,7.5; D4 -7.5,7.5; D5 -6.5,7.5; D6 -5.5,7.5; D7 -4.5,7.5; D8 -3.5,7.5; D9 -2.5,7.5; D10 -1.5,7.5; D11 -0.5,7.5; D12 0.5,7.5; D13 1.5,7.5; D14 2.5,7.5; D15 3.5,7.5; D16 4.5,7.5; D17 5.5,7.5; D18 6.5,7.5; D19 7.5,7.5; D20 8.5,7.5; D21 9.5,7.5; D22 10.5,7.5; E1 -10.5,6.5; E2 -9.5,6.5; E3 -8.5,6.5; E4 -7.5,6.5; E5 -6.5,6.5; E6 -5.5,6.5; E7 -4.5,6.5; E8 -3.5,6.5; E9 -2.5,6.5; E10 -1.5,6.5; E11 -0.5,6.5; E12 0.5,6.5; E13 1.5,6.5; E14 2.5,6.5; E15 3.5,6.5; E16 4.5,6.5; E17 5.5,6.5; E18 6.5,6.5; E19 7.5,6.5; E20 8.5,6.5; E21 9.5,6.5; E22 10.5,6.5; F1 -10.5,5.5; F2 -9.5,5.5; F3 -8.5,5.5; F4 -7.5,5.5; F5 -6.5,5.5; F6 -5.5,5.5; F7 -4.5,5.5; F8 -3.5,5.5; F9 -2.5,5.5; F10 -1.5,5.5; F11 -0.5,5.5; F12 0.5,5.5; F13 1.5,5.5; F14 2.5,5.5; F15 3.5,5.5; F16 4.5,5.5; F17 5.5,5.5; F18 6.5,5.5; F19 7.5,5.5; F20 8.5,5.5; F21 9.5,5.5; F22 10.5,5.5; G1 -10.5,4.5; G2 -9.5,4.5; G3 -8.5,4.5; G4 -7.5,4.5; G5 -6.5,4.5; G6 -5.5,4.5; G7 -4.5,4.5; G8 -3.5,4.5; G9 -2.5,4.5; G10 -1.5,4.5; G11 -0.5,4.5; G12 0.5,4.5; G13 1.5,4.5; G14 2.5,4.5; G15 3.5,4.5; G16 4.5,4.5; G17 5.5,4.5; G18 6.5,4.5; G19 7.5,4.5; G20 8.5,4.5; G21 9.5,4.5; G22 10.5,4.5; H1 -10.5,3.5; H2 -9.5,3.5; H3 -8.5,3.5; H4 -7.5,3.5; H5 -6.5,3.5; H6 -5.5,3.5; H7 -4.5,3.5; H8 -3.5,3.5; H9 -2.5,3.5; H10 -1.5,3.5; H11 -0.5,3.5; H12 0.5,3.5; H13 1.5,3.5; H14 2.5,3.5; H15 3.5,3.5; H16 4.5,3.5; H17 5.5,3.5; H18 6.5,3.5; H19 7.5,3.5; H20 8.5,3.5; H21 9.5,3.5; H22 10.5,3.5; J1 -10.5,2.5; J2 -9.5,2.5; J3 -8.5,2.5; J4 -7.5,2.5; J5 -6.5,2.5; J6 -5.5,2.5; J7 -4.5,2.5; J8 -3.5,2.5; J9 -2.5,2.5; J10 -1.5,2.5; J11 -0.5,2.5; J12 0.5,2.5; J13 1.5,2.5; J14 2.5,2.5; J15 3.5,2.5; J16 4.5,2.5; J17 5.5,2.5; J18 6.5,2.5; J19 7.5,2.5; J20 8.5,2.5; J21 9.5,2.5; J22 10.5,2.5; K1 -10.5,1.5; K2 -9.5,1.5; K3 -8.5,1.5; K4 -7.5,1.5; K5 -6.5,1.5; K6 -5.5,1.5; K7 -4.5,1.5; K8 -3.5,1.5; K9 -2.5,1.5; K10 -1.5,1.5; K11 -0.5,1.5; K12 0.5,1.5; K13 1.5,1.5; K14 2.5,1.5; K15 3.5,1.5; K16 4.5,1.5; K17 5.5,1.5; K18 6.5,1.5; K19 7.5,1.5; K20 8.5,1.5; K21 9.5,1.5; K22 10.5,1.5; L1 -10.5,0.5; L2 -9.5,0.5; L3 -8.5,0.5; L4 -7.5,0.5; L5 -6.5,0.5; L6 -5.5,0.5; L7 -4.5,0.5; L8 -3.5,0.5; L9 -2.5,0.5; L10 -1.5,0.5; L11 -0.5,0.5; L12 0.5,0.5; L13 1.5,0.5; L14 2.5,0.5; L15 3.5,0.5; L16 4.5,0.5; L17 5.5,0.5; L18 6.5,0.5; L19 7.5,0.5; L20 8.5,0.5; L21 9.5,0.5; L22 10.5,0.5; M1 -10.5,-0.5; M2 -9.5,-0.5; M3 -8.5,-0.5; M4 -7.5,-0.5; M5 -6.5,-0.5; M6 -5.5,-0.5; M7 -4.5,-0.5; M8 -3.5,-0.5; M9 -2.5,-0.5; M10 -1.5,-0.5; M11 -0.5,-0.5; M12 0.5,-0.5; M13 1.5,-0.5; M14 2.5,-0.5; M15 3.5,-0.5; M16 4.5,-0.5; M17 5.5,-0.5; M18 6.5,-0.5; M19 7.5,-0.5; M20 8.5,-0.5; M21 9.5,-0.5; M22 10.5,-0.5; N1 -10.5,-1.5; N2 -9.5,-1.5; N3 -8.5,-1.5; N4 -7.5,-1.5; N5 -6.5,-1.5; N6 -5.5,-1.5; N7 -4.5,-1.5; N8 -3.5,-1.5; N9 -2.5,-1.5; N10 -1.5,-1.5; N11 -0.5,-1.5; N12 0.5,-1.5; N13 1.5,-1.5; N14 2.5,-1.5; N15 3.5,-1.5; N16 4.5,-1.5; N17 5.5,-1.5; N18 6.5,-1.5; N19 7.5,-1.5; N20 8.5,-1.5; N21 9.5,-1.5; N22 10.5,-1.5; P1 -10.5,-2.5; P2 -9.5,-2.5; P3 -8.5,-2.5; P4 -7.5,-2.5; P5 -6.5,-2.5; P6 -5.5,-2.5; P7 -4.5,-2.5; P8 -3.5,-2.5; P9 -2.5,-2.5; P10 -1.5,-2.5; P11 -0.5,-2.5; P12 0.5,-2.5; P13 1.5,-2.5; P14 2.5,-2.5; P15 3.5,-2.5; P16 4.5,-2.5; P17 5.5,-2.5; P18 6.5,-2.5; P19 7.5,-2.5; P20 8.5,-2.5; P21 9.5,-2.5; P22 10.5,-2.5; R1 -10.5,-3.5; R2 -9.5,-3.5; R3 -8.5,-3.5; R4 -7.5,-3.5; R5 -6.5,-3.5; R6 -5.5,-3.5; R7 -4.5,-3.5; R8 -3.5,-3.5; R9 -2.5,-3.5; R10 -1.5,-3.5; R11 -0.5,-3.5; R12 0.5,-3.5; R13 1.5,-3.5; R14 2.5,-3.5; R15 3.5,-3.5; R16 4.5,-3.5; R17 5.5,-3.5; R18 6.5,-3.5; R19 7.5,-3.5; R20 8.5,-3.5; R21 9.5,-3.5; R22 10.5,-3.5; T1 -10.5,-4.5; T2 -9.5,-4.5; T3 -8.5,-4.5; T4 -7.5,-4.5; T5 -6.5,-4.5; T6 -5.5,-4.5; T7 -4.5,-4.5; T8 -3.5,-4.5; T9 -2.5,-4.5; T10 -1.5,-4.5; T11 -0.5,-4.5; T12 0.5,-4.5; T13 1.5,-4.5; T14 2.5,-4.5; T15 3.5,-4.5; T16 4.5,-4.5; T17 5.5,-4.5; T18 6.5,-4.5; T19 7.5,-4.5; T20 8.5,-4.5; T21 9.5,-4.5; T22 10.5,-4.5; U1 -10.5,-5.5; U2 -9.5,-5.5; U3 -8.5,-5.5; U4 -7.5,-5.5; U5 -6.5,-5.5; U6 -5.5,-5.5; U7 -4.5,-5.5; U8 -3.5,-5.5; U9 -2.5,-5.5; U10 -1.5,-5.5; U11 -0.5,-5.5; U12 0.5,-5.5; U13 1.5,-5.5; U14 2.5,-5.5; U15 3.5,-5.5; U16 4.5,-5.5; U17 5.5,-5.5; U18 6.5,-5.5; U19 7.5,-5.5; U20 8.5,-5.5; U21 9.5,-5.5; U22 10.5,-5.5; V1 -10.5,-6.5; V2 -9.5,-6.5; V3 -8.5,-6.5; V4 -7.5,-6.5; V5 -6.5,-6.5; V6 -5.5,-6.5; V7 -4.5,-6.5; V8 -3.5,-6.5; V9 -2.5,-6.5; V10 -1.5,-6.5; V11 -0.5,-6.5; V12 0.5,-6.5; V13 1.5,-6.5; V14 2.5,-6.5; V15 3.5,-6.5; V16 4.5,-6.5; V17 5.5,-6.5; V18 6.5,-6.5; V19 7.5,-6.5; V20 8.5,-6.5; V21 9.5,-6.5; V22 10.5,-6.5; W1 -10.5,-7.5; W2 -9.5,-7.5; W3 -8.5,-7.5; W4 -7.5,-7.5; W5 -6.5,-7.5; W6 -5.5,-7.5; W7 -4.5,-7.5; W8 -3.5,-7.5; W9 -2.5,-7.5; W10 -1.5,-7.5; W11 -0.5,-7.5; W12 0.5,-7.5; W13 1.5,-7.5; W14 2.5,-7.5; W15 3.5,-7.5; W16 4.5,-7.5; W17 5.5,-7.5; W18 6.5,-7.5; W19 7.5,-7.5; W20 8.5,-7.5; W21 9.5,-7.5; W22 10.5,-7.5; Y1 -10.5,-8.5; Y2 -9.5,-8.5; Y3 -8.5,-8.5; Y4 -7.5,-8.5; Y5 -6.5,-8.5; Y6 -5.5,-8.5; Y7 -4.5,-8.5; Y8 -3.5,-8.5; Y9 -2.5,-8.5; Y10 -1.5,-8.5; Y11 -0.5,-8.5; Y12 0.5,-8.5; Y13 1.5,-8.5; Y14 2.5,-8.5; Y15 3.5,-8.5; Y16 4.5,-8.5; Y17 5.5,-8.5; Y18 6.5,-8.5; Y19 7.5,-8.5; Y20 8.5,-8.5; Y21 9.5,-8.5; Y22 10.5,-8.5
SOIC127P600X175-8N = smd 1.5 x 0.7: 1 -2.7,1.905; 2 -2.7,0.635; 3 -2.7,-0.635; 4 -2.7,-1.905; 5 2.7,-1.905; 6 2.7,-0.635; 7 2.7,0.635; 8 2.7,1.905
2X5-SHROUDED = drill 1.016 pad 1.88: 1 -1.27,5.08; 2 1.27,5.08; 3 -1.27,2.54; 4 1.27,2.54; 5 -1.27,0; 6 1.27,0; 7 -1.27,-2.54; 8 1.27,-2.54; 9 -1.27,-5.08; 10 1.27,-5.08
1X01 = drill 1.016 octagon: 1 0,0
1X08 = drill 1.016 long: 1 -8.89,0; 2 -6.35,0; 3 -3.81,0; 4 -1.27,0; 5 1.27,0; 6 3.81,0; 7 6.35,0; 8 8.89,0
CHIP-LED0603 = smd 0.8 x 0.8: A 0,-0.75; C 0,0.75
RES-0402 = smd 0.5 x 0.6: P$1 -0.5,0; P$2 0.5,0
SW4-SMD-5.2X5.2X1.5MM = smd 1 x 0.7: 1 -3,1.85; 2 3,1.85; 3 -3,-1.85; 4 3,-1.85
SOT-223-3 = smd 1.5 x 4: P$1 3.25,0 | smd 1.5 x 1: P$2 -3.25,2.3; P$3 -3.25,0; P$4 -3.25,-2.3
OSCILLATOR-SMD-5X3.2 = smd 1.397 x 1.194: 1 -1.27,-1.1; 2 1.27,-1.1; 3 1.27,1.1; 4 -1.27,1.1

## Placement (x,y rotation side)
C1  0.1uF  [RESC0402_N]  3.06,75.3 90 top
C2  10uF  [RESC0805_N]  125.5,102 90 top
C3  0.1uF  [RESC0402_N]  123.5,102 90 top
C4  10uF  [RESC0805_N]  109,102 90 top
C5  0.1uF  [RESC0402_N]  107,102 90 top
C6  10uF  [RESC0805_N]  152,102 270 top
C7  0.1uF  [RESC0402_N]  154,102 270 top
C8  10uF  [RESC0805_N]  142,102 90 top
C9  0.1uF  [RESC0402_N]  140,102 90 top
C10  10uF  [RESC0805_N]  135.5,102 270 top
C11  0.1uF  [RESC0402_N]  137.5,102 270 top
C12  10uF  [RESC0805_N]  119,102 270 top
C13  0.1uF  [RESC0402_N]  121,102 270 top
C14  0.1uF  [RESC0402_N]  56.52,71.64 270 top
C15  0.1uF  [RESC0402_N]  45.5,111 90 top
C16  0.1uF  [RESC0402_N]  78,72.5 270 bottom
C17  0.1uF  [RESC0402_N]  80,56.5 90 bottom
C18  0.1uF  [RESC0402_N]  69,72.5 270 bottom
C19  0.1uF  [RESC0402_N]  65.5,75 180 bottom
C20  0.1uF  [RESC0402_N]  85.5,75 0 bottom
C21  0.1uF  [RESC0402_N]  69,56.5 90 bottom
C22  0.1uF  [RESC0402_N]  85.5,54 0 bottom
C23  0.1uF  [RESC0402_N]  65.5,54 180 bottom
C24  0.1uF  [RESC0402_N]  78.5,67 0 bottom
C25  0.1uF  [RESC0402_N]  69.5,59 180 bottom
C26  0.1uF  [RESC0402_N]  82,70.5 270 bottom
IC1  EP4CE30F23C6N  [BGA484C100P22X22_2300X2300X240]  75.5,64.5 0 top
IC2  EPCQ16ASI8N  [SOIC127P600X175-8N]  8,76.5 0 top
J1  2x5  [2X5-SHROUDED]  7,38.5 0 top
JP1  1  [1X01]  148,3 0 top
JP2  1  [1X01]  87,96.5 0 top
JP3  1x8  [1X08]  144.5,110.5 0 top
JP4  1  [1X01]  84.5,96.5 0 top
JP5  1  [1X01]  102,79 0 top
JP6  1  [1X01]  102,76.5 0 top
JP7  1  [1X01]  38.5,73.5 0 top
JP8  1  [1X01]  38.5,71 0 top
JP9  1  [1X01]  38.5,68.5 0 top
JP10  1  [1X01]  38.5,76 0 top
JP11  1  [1X01]  72,96.5 0 top
JP12  1  [1X01]  69.5,96.5 0 top
JP13  1  [1X01]  23.5,112 0 top
JP14  1  [1X01]  74.5,96.5 0 top
JP15  1  [1X01]  77,96.5 0 top
JP16  1  [1X01]  49.5,69 0 top
JP17  1  [1X01]  44,60 0 top
JP18  1  [1X01]  44,62.5 0 top
JP19  1  [1X01]  102,69 0 top
JP20  1  [1X01]  102,66.5 0 top
JP21  1  [1X01]  102,60 0 top
JP22  1  [1X01]  102,57.5 0 top
JP23  1  [1X01]  79.5,96.5 0 top
JP24  1  [1X01]  82,96.5 0 top
JP25  1  [1X01]  77.5,93 0 top
JP26  1  [1X01]  75,93 0 top
JP27  1  [1X01]  76,28.5 0 top
JP28  1  [1X01]  72,28.5 0 top
JP29  1  [1X01]  63.5,28.5 0 top
JP30  1  [1X01]  67.5,28.5 0 top
JP31  1  [1X01]  7.5,3 0 top
JP32  1  [1X01]  79,101 0 top
JP33  1  [1X01]  86.5,101 0 top
JP34  1  [1X01]  84,101 0 top
JP35  1  [1X01]  124,90 0 top
JP36  1  [1X01]  121.5,87.5 0 top
JP37  1  [1X01]  121.5,85 0 top
JP38  1  [1X01]  121.5,90 0 top
JP39  1  [1X01]  12.5,82 0 top
JP40  1  [1X01]  18,92 0 top
JP41  1  [1X01]  70.5,109 0 top
JP42  1  [1X01]  65.5,109 0 top
JP43  1  [1X01]  74,101 0 top
JP44  1  [1X01]  80.5,109 0 top
JP45  1  [1X01]  27,108.5 0 top
JP46  1  [1X01]  24.5,108.5 0 top
JP47  1  [1X01]  91.5,101 0 top
JP48  1  [1X01]  83,109 0 top
JP49  1  [1X01]  121.5,80 0 top
JP50  1  [1X01]  121.5,77.5 0 top
JP51  1  [1X01]  121.5,82.5 0 top
JP52  1  [1X01]  124,87.5 0 top
JP53  1  [1X01]  18,77 0 top
JP54  1  [1X01]  5.5,82 0 top
JP55  1  [1X01]  18,84.5 0 top
JP56  1  [1X01]  18,87 0 top
JP57  1  [1X01]  22,108.5 0 top
JP58  1  [1X01]  18,82 0 top
JP59  1  [1X01]  18,89.5 0 top
JP60  1  [1X01]  68,109 0 top
JP61  1  [1X01]  75.5,109 0 top
JP62  1  [1X01]  73,109 0 top
JP63  1  [1X01]  71.5,101 0 top
JP64  1  [1X01]  78,109 0 top
JP65  1  [1X01]  81.5,101 0 top
JP66  1  [1X01]  76.5,101 0 top
JP67  1  [1X01]  89,101 0 top
JP68  1  [1X01]  85.5,109 0 top
JP69  1  [1X01]  126.5,77.5 0 top
JP70  1  [1X01]  124,77.5 0 top
JP71  1  [1X01]  18,74.5 0 top
JP72  1  [1X01]  18,79.5 0 top
JP73  1  [1X01]  19.5,108.5 0 top
LED33  red  [CHIP-LED0603]  45.5,102 180 top
LED34  red  [CHIP-LED0603]  48.5,102 180 top
LED35  red  [CHIP-LED0603]  52,102 180 top
LED36  red  [CHIP-LED0603]  55,102 180 top
LED37  red  [CHIP-LED0603]  58,102 180 top
LED38  red  [CHIP-LED0603]  61,102 180 top
LED39  red  [CHIP-LED0603]  64,102 180 top
LED40  red  [CHIP-LED0603]  67,102 180 top
R1  10k  [RES-0402]  45.5,113.5 90 top
R2  10k  [RES-0402]  10.5,66.5 90 top
R3  10k  [RES-0402]  149.5,64 0 top
R4  0  [RES-0402]  5.5,55 180 top
R5  10k  [RES-0402]  5.5,58.5 180 top
R6  10k  [RES-0402]  149.5,60.5 0 top
R7  10k  [RES-0402]  149.5,67.5 0 top
R8  10k  [RES-0402]  149.5,71 0 top
R9  10k  [RES-0402]  149.5,74.5 0 top
R17  0  [RES-0402]  125.5,109.5 180 top
R18  0  [RES-0402]  109,106.5 180 top
R19  0  [RES-0402]  109,109.5 180 top
R20  0  [RES-0402]  125.5,106.5 180 top
R38  1k  [RES-0402]  67,105 270 top
R39  1k  [RES-0402]  64,105 270 top
R40  1k  [RES-0402]  61,105 270 top
R41  1k  [RES-0402]  58,105 270 top
R42  1k  [RES-0402]  55,105 270 top
R43  1k  [RES-0402]  52,105 270 top
R44  1k  [RES-0402]  48.5,105 270 top
R45  1k  [RES-0402]  45.5,105 270 top
SW1  SKQGADE010  [SW4-SMD-5.2X5.2X1.5MM]  6,64 0 top
SW2  SKQGADE010  [SW4-SMD-5.2X5.2X1.5MM]  41,111 0 top
U1  AMS1117-3.3  [SOT-223-3]  147,102 90 top
U2  AMS1117-2.5  [SOT-223-3]  130.5,102 90 top
U3  AMS1117-1.2  [SOT-223-3]  114,102 90 top
Y1  OSCILLATORSMD-5X3  [OSCILLATOR-SMD-5X3.2]  57.98,67.86 0 top